# EasyEDA Pro project ProPrj_STM32门禁系统_2025-03-02.epro

# Schematic Schematic1

## Sheets
1 STM32主控: Board Name: Board1; Create Date: 2025-02-06; Page Name: STM32主控; Project Name: STM32门禁系统; Schematic Name: Schematic1; Update Date: 2025-03-01; Company: 嘉立创EDA; Page Size: A4; Version: V1.1
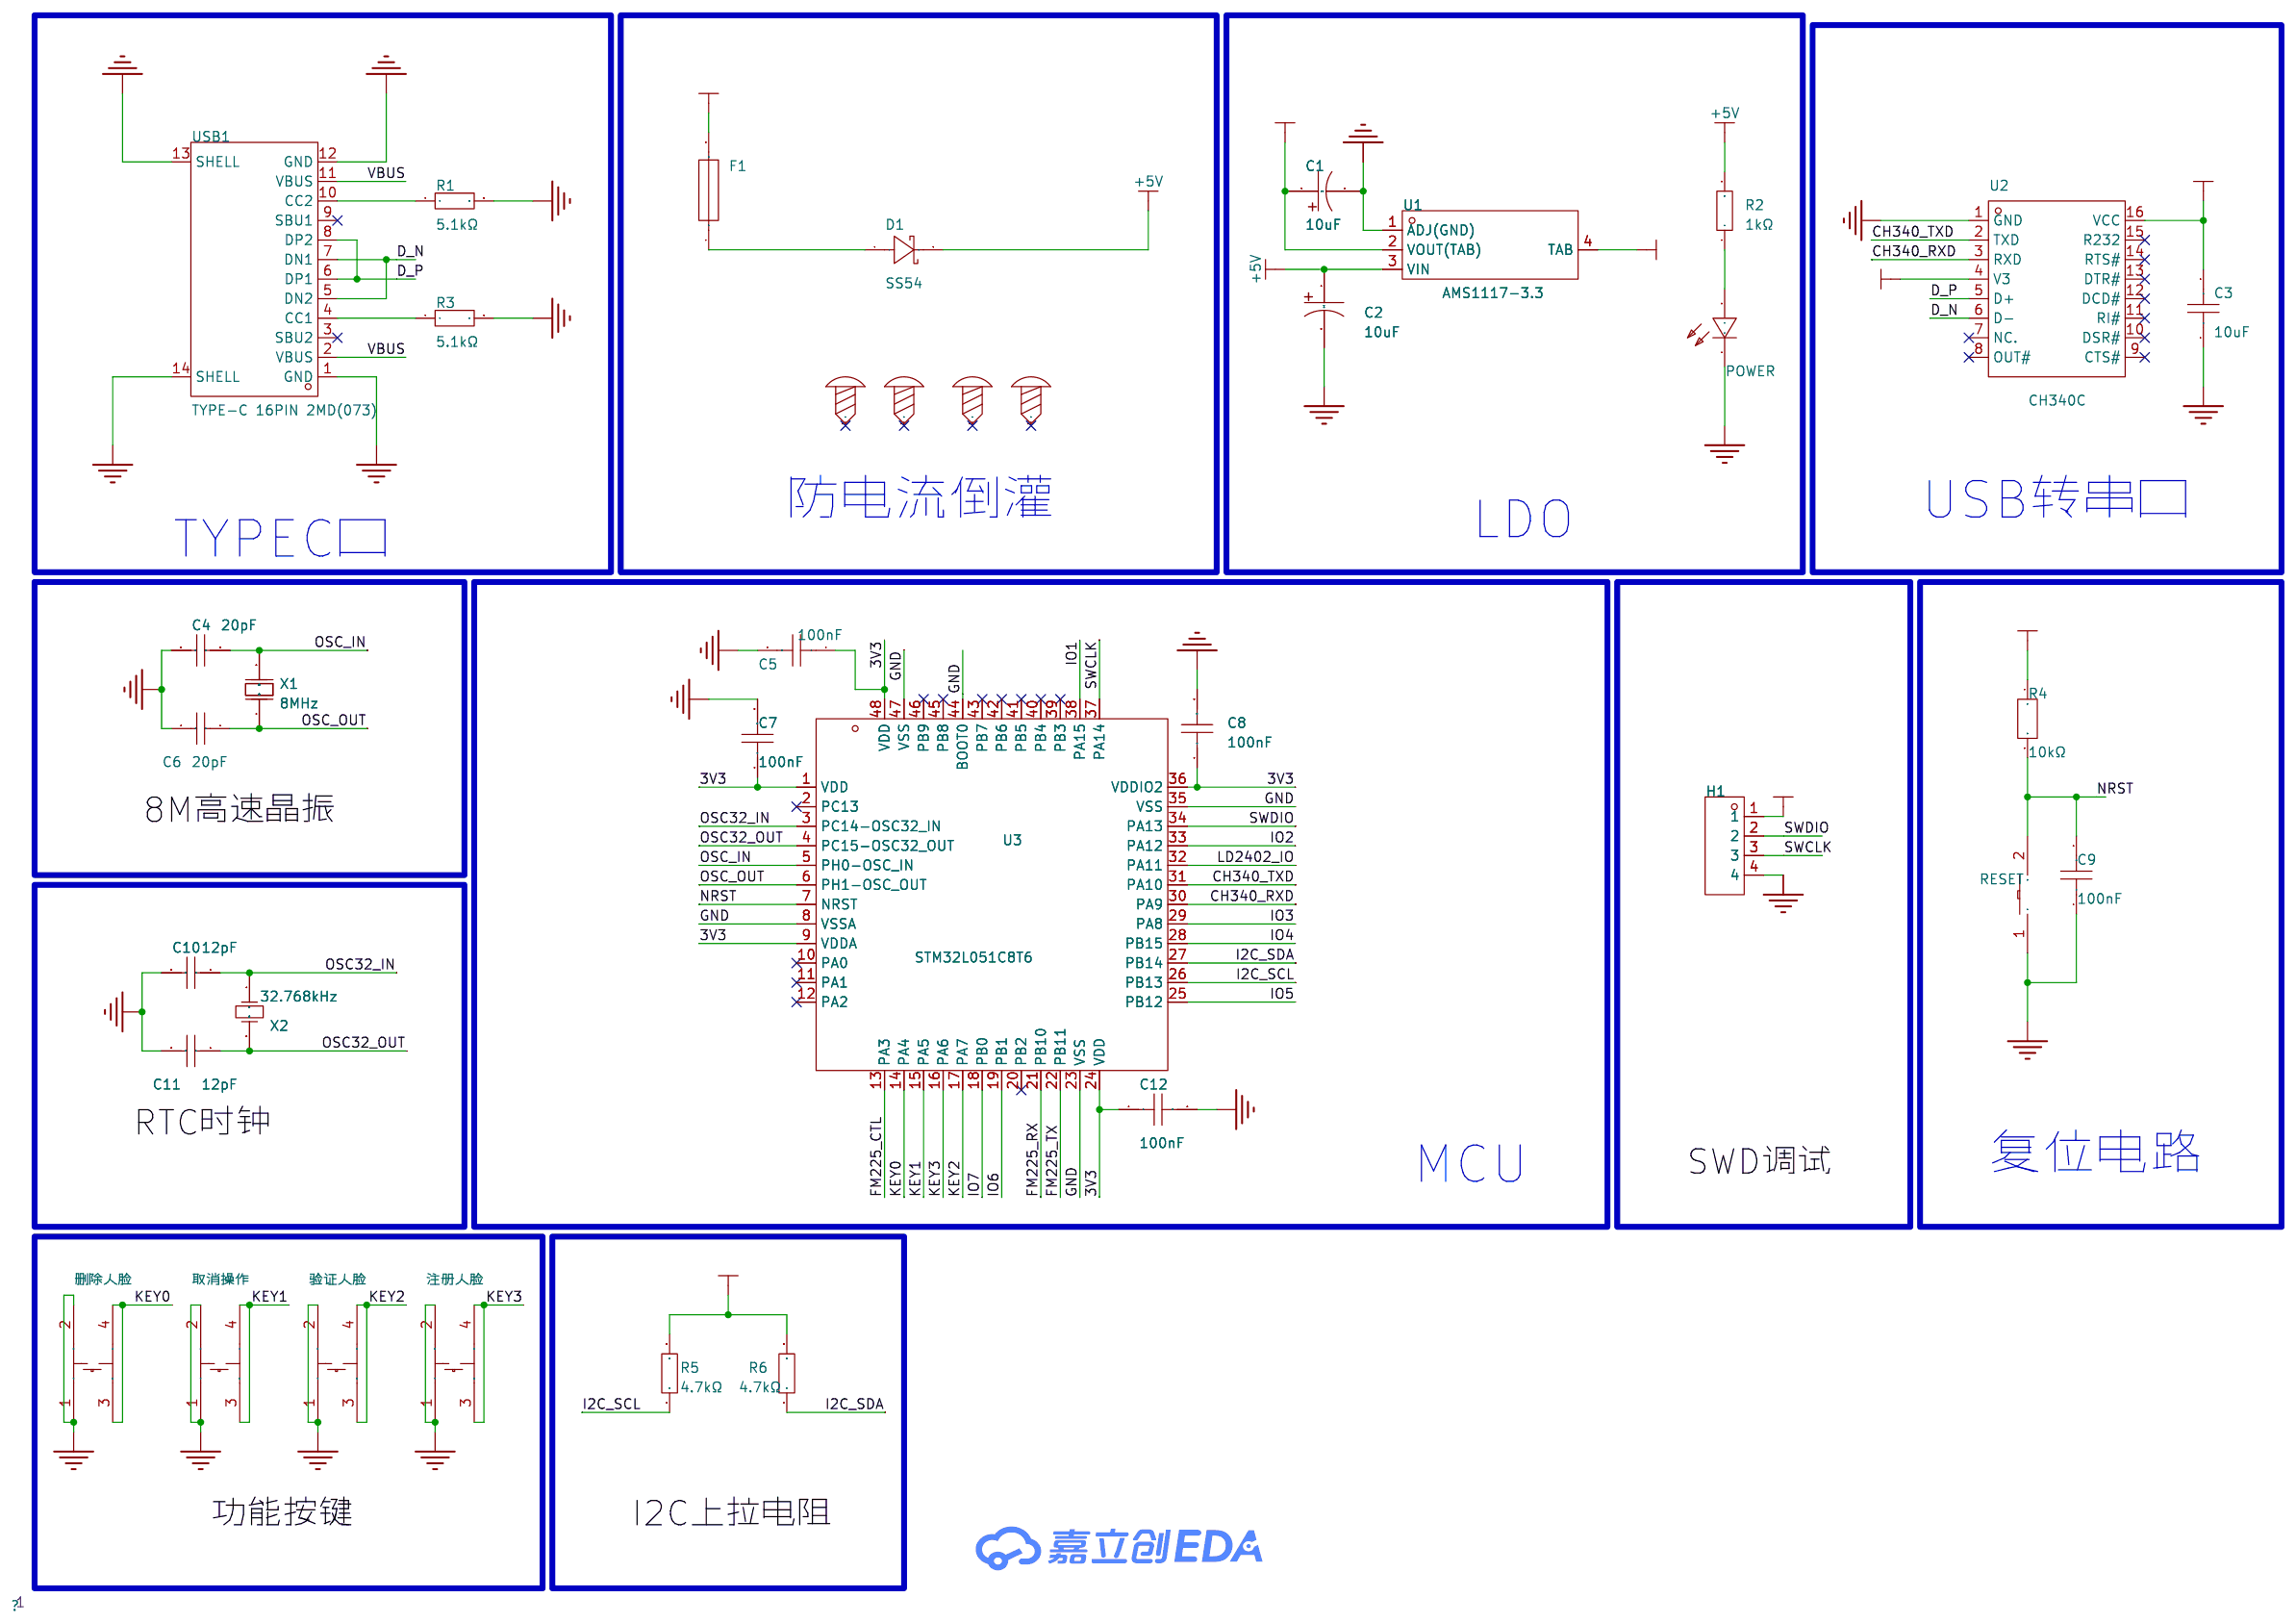
[diagram p0: STM32主控]
2 other: Page Name: other
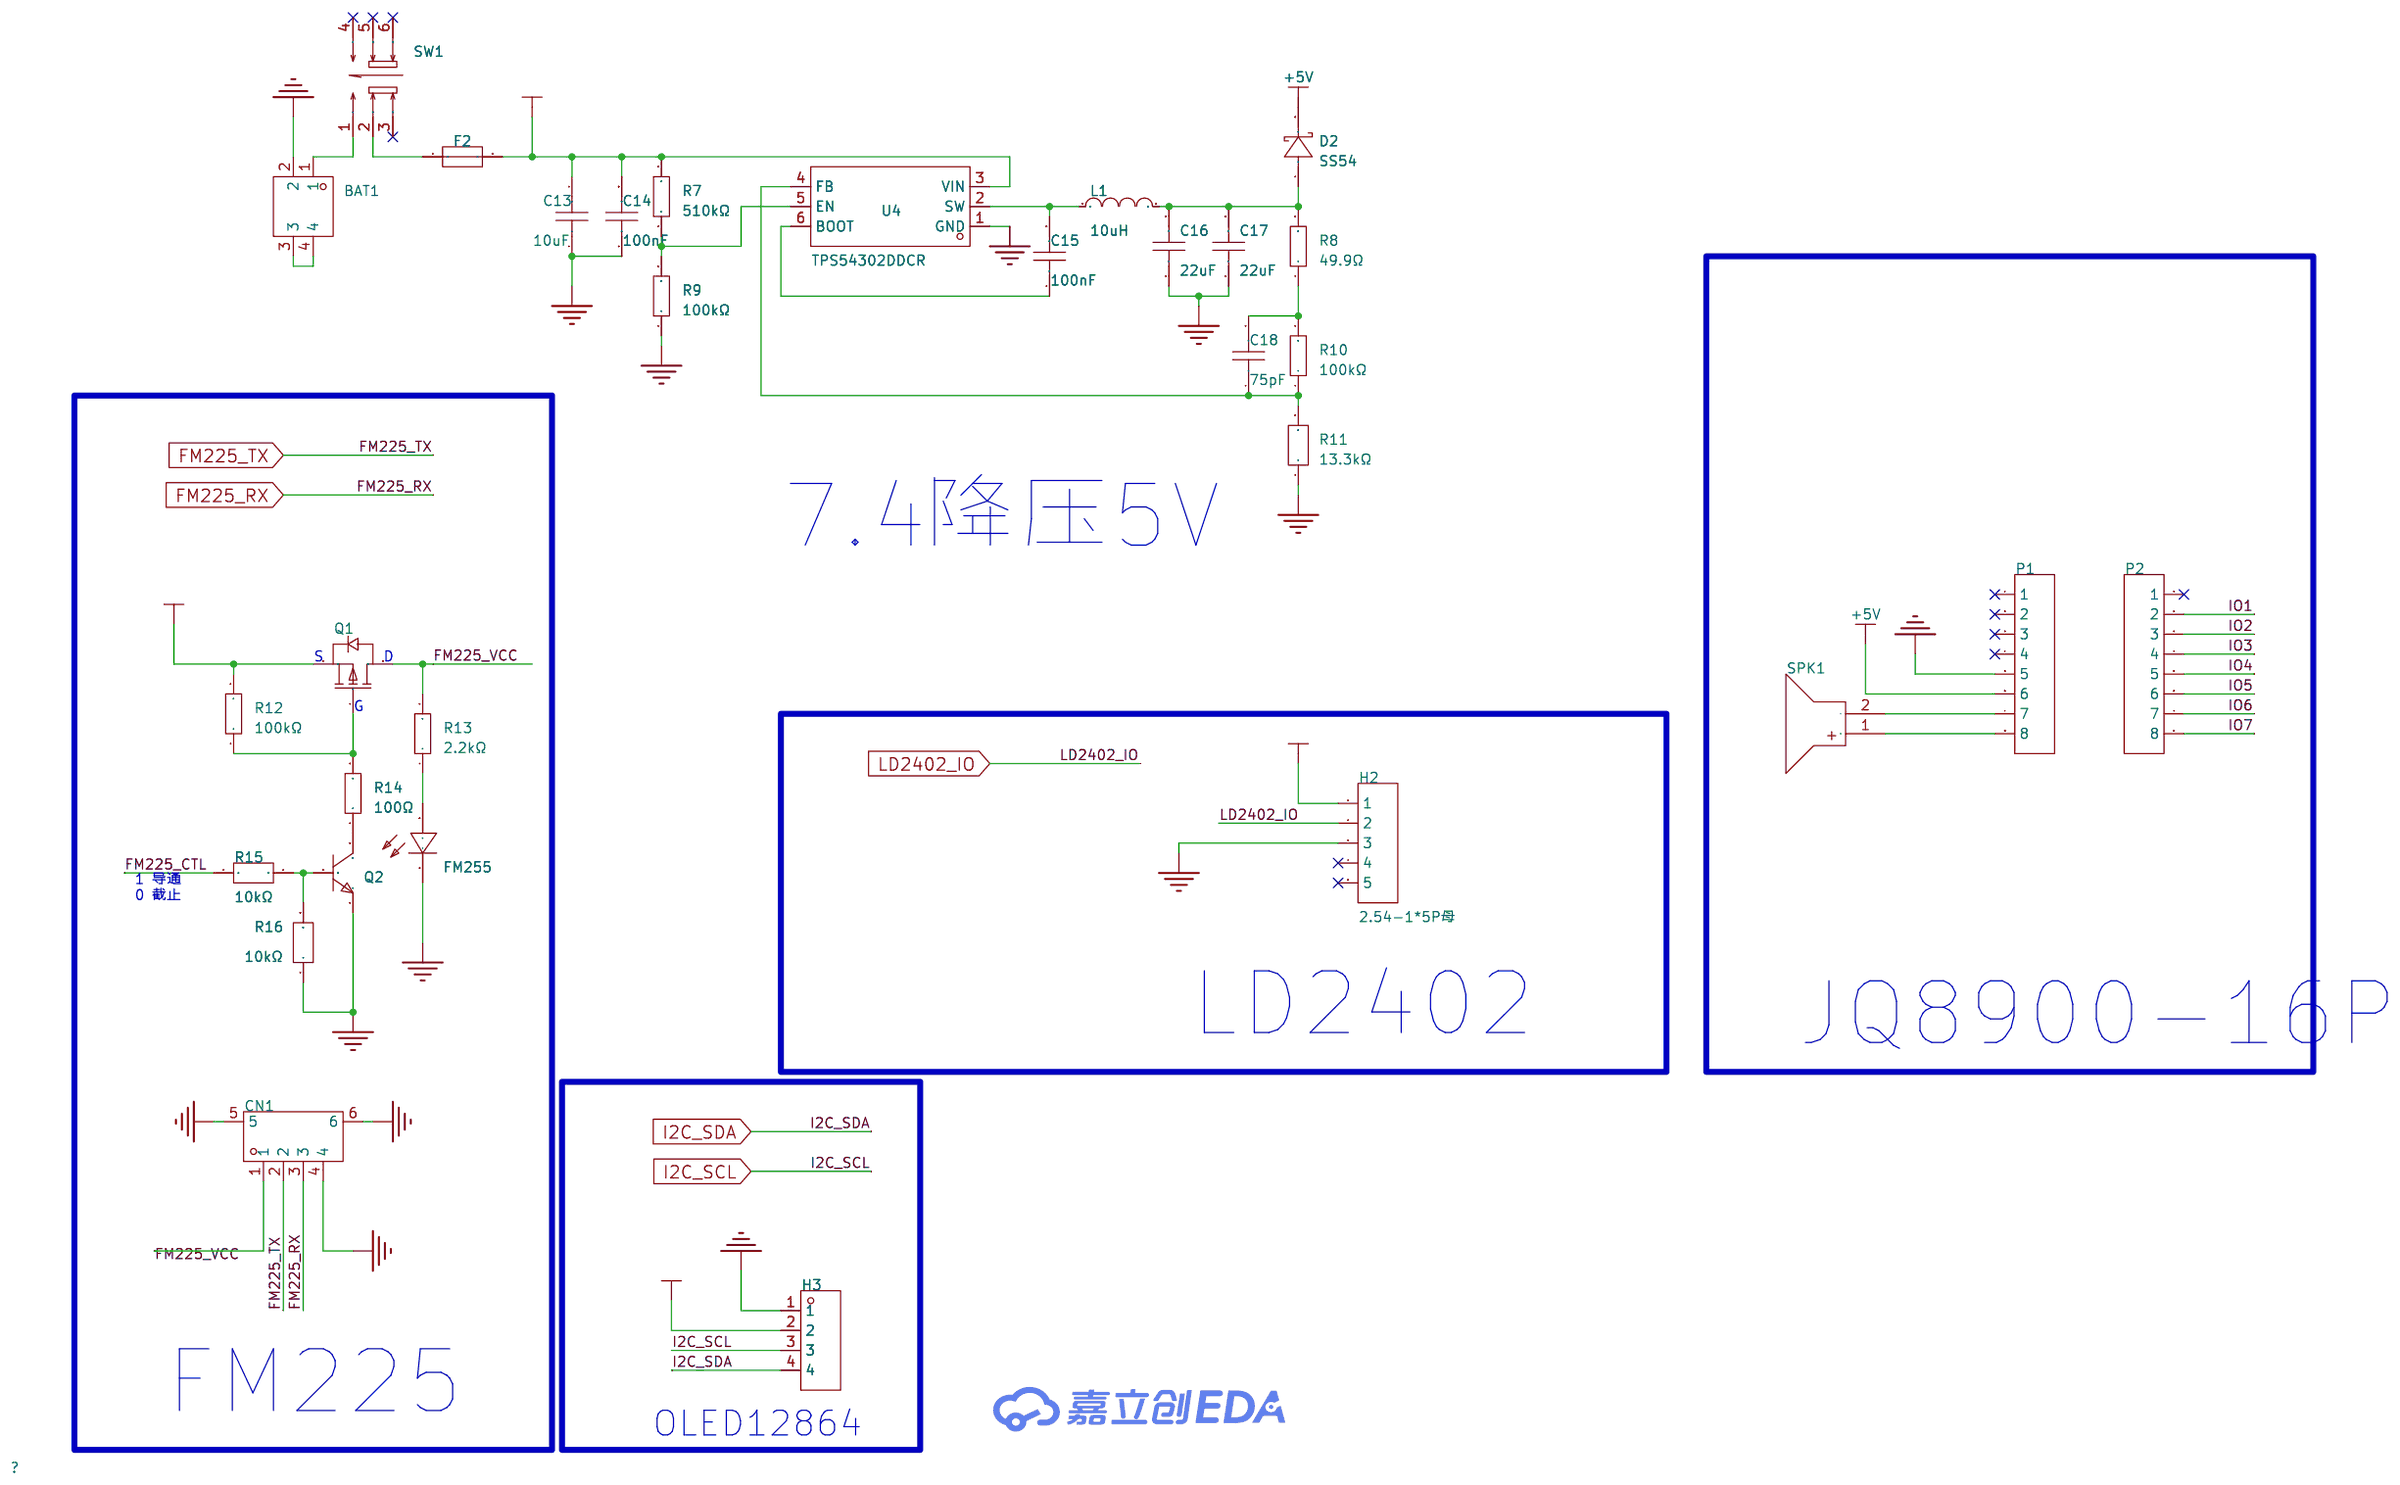
[diagram p1: other]

## Parts
sheet other
BAT1  BH-18650-A1BJ021  [BAT-TH_L77.0-W39.9_BH-18650-A1BJ021]
C13  10uF  [C0603]
C14  100nF  [C0603]
C15  100nF  [C0603]
C16  22uF  [C0603]
C17  22uF  [C0603]
C18  75pF  [C0603]
CN1  HC-1.25-4PLT  [CONN-SMD_4P-P1.25_HCTL_HC-1.25-4PLT]
D2  SS54  [SMA_L4.3-W2.6-LS5.0-FD]
F2  BSMD1210-150-16V  [F1210]
FM255  NCD0603W3  [LED0603-RD]
H2  2.54-1*5P母  [HDR-TH_5P-P2.54-V-F]
H3  2.54-1*4P母  [HDR-TH_4P-P2.54-V-F]
L1  10uH  [IND-SMD_L7.3-W6.8]
P1  2.54-1*8P母环保  [HDR-TH_8P-P2.54-V-F-1]
P2  2.54-1*8P母环保  [HDR-TH_8P-P2.54-V-F-1]
Q1  SI2301  [SOT-23-3_L2.9-W1.3-P1.90-LS2.4-BR]
Q2  S8050  [SOT-23-3_L2.9-W1.3-P1.90-LS2.4-BR]
R7  510kΩ  [R0603]
R8  49.9Ω  [R0603]
R9  100kΩ  [R0603]
R10  100kΩ  [R0603]
R11  13.3kΩ  [R0603]
R12  100kΩ  [R0603]
R13  2.2kΩ  [R0603]
R14  100Ω  [R0603]
R15  10kΩ  [R0603]
R16  10kΩ  [R0603]
SPK1  GSPK2307P-8R1W  [SPK-TH_BD23.0-P10.00-D0.8-L-RD]
SW1  XKB7070-Z  [SW-TH_6P-L7.0-W7.0-P2.00]
U4  TPS54302DDCR  [SOT-23-6_L2.9-W1.6-P0.95-LS2.8-BL]
sheet STM32主控
C1  10uF  [CAP-SMD_L3.2-W1.6]
C2  10uF  [CAP-SMD_L3.2-W1.6]
C3  10uF  [C0603]
C4  20pF  [C0603]
C5  100nF  [C0603]
C6  20pF  [C0603]
C7  100nF  [C0603]
C8  100nF  [C0603]
C9  100nF  [C0603]
C10  12pF  [C0603]
C11  12pF  [C0603]
C12  100nF  [C0603]
D1  SS54  [SMA_L4.3-W2.6-LS5.0-FD]
F1  JK-nSMD050-30  [F1206]
H1  PZ254V-11-04P  [HDR-TH_4P-P2.54-V-M]
POWER  NCD0603R1  [LED0603-RD_RED]
R1  5.1kΩ  [R0603]
R2  1kΩ  [R0603]
R3  5.1kΩ  [R0603]
R4  10kΩ  [R0603]
R5  4.7kΩ  [R0603]
R6  4.7kΩ  [R0603]
RESET  TS-1101-C-W  [SW-SMD_L6.0-W3.3-LS8.0]
SCREW1  -  [M2螺丝]  (no BOM)
SCREW2  -  [M2螺丝]  (no BOM)
SCREW3  -  [M2螺丝]  (no BOM)
SCREW4  -  [M2螺丝]  (no BOM)
U1  AMS1117-3.3  [SOT-223-4_L6.5-W3.5-P2.30-LS7.0-BR]
U2  CH340C  [SOP-16_L10.0-W3.9-P1.27-LS6.0-BL]
U3  STM32L051C8T6  [LQFP-48_L7.0-W7.0-P0.50-LS9.0-BL]
USB1  TYPE-C 16PIN 2MD(073)  [USB-C-SMD_TYPE-C-6PIN-2MD-073]
X1  8MHz  [HC-49US_L11.5-W4.5-P4.88]
X2  32.768kHz  [OSC-TH_BD3.1-P0.8-D0.3]
删除人脸  TS-1002S-06026C  [KEY-SMD_4P-L6.0-W6.0-P4.50-LS9.5-BR]
取消操作  TS-1002S-06026C  [KEY-SMD_4P-L6.0-W6.0-P4.50-LS9.5-BR]
注册人脸  TS-1002S-06026C  [KEY-SMD_4P-L6.0-W6.0-P4.50-LS9.5-BR]
验证人脸  TS-1002S-06026C  [KEY-SMD_4P-L6.0-W6.0-P4.50-LS9.5-BR]

## Library data of the parts
BAT1 = BH-18650-A1BJ021: 连接器类型:电池盒;适用电池规格:-;触点电镀:镍;工作温度范围:-25℃~+85℃;; LCSC Part Name: 电池盒; Supplier Part: C20606804; Manufacturer: MYOUNG(美阳); Supplier Footprint: 插件; JLCPCB Part Class: 扩展库; Datasheet: https://atta.szlcsc.com/upload/public/pdf/source/20240112/147D77B47FAFC966051AFF7CD950677D.pdf; Supplier: LCSC; Connector Type: 电池盒; Contact Plating: 镍; Operating Temperature Range: -25℃~+85℃
C3 C13 = CL10A106KP8NNNC: 容值:10uF;精度:±10%;额定电压:10V;材质(温度系数):X5R;; LCSC Part Name: 10uF ±10% 10V; Supplier Part: C19702; Manufacturer: SAMSUNG(三星); Supplier Footprint: 0603; JLCPCB Part Class: 基础库; Datasheet: https://atta.szlcsc.com/upload/public/pdf/source/20160218/1457707763339.pdf; Supplier: LCSC; Tolerance: ±10%; Voltage Rated: 10V; Temperature Coefficient: X5R
C5 C7-C9 C12 C14 C15 = CGA0603X7R104K500JT: 容值:100nF;精度:±10%;额定电压:50V;材质(温度系数):X7R;; LCSC Part Name: 100nF ±10% 50V; Supplier Part: C6119867; Manufacturer: HRE(芯声); Supplier Footprint: 0603; Supplier: LCSC; Tolerance: ±10%; Voltage Rated: 50V; Temperature Coefficient: X7R
C16 C17 = CL10A226MQ8NRNC: 容值:22uF;精度:±20%;额定电压:6.3V;材质(温度系数):X5R;; LCSC Part Name: 22uF ±20% 6.3V; Supplier Part: C59461; Manufacturer: SAMSUNG(三星); Supplier Footprint: 0603; JLCPCB Part Class: 基础库; Datasheet: https://atta.szlcsc.com/upload/public/pdf/source/20160218/1457707763339.pdf; Supplier: LCSC; Tolerance: ±20%; Voltage Rated: 6.3V; Temperature Coefficient: X5R
C18 = CC0603JRNPO9BN750: 容值:75pF;精度:±5%;额定电压:50V;材质(温度系数):NP0;; LCSC Part Name: 75pF ±5% 50V; Supplier Part: C282074; Manufacturer: YAGEO(国巨); Supplier Footprint: 0603; JLCPCB Part Class: 扩展库; Datasheet: https://atta.szlcsc.com/upload/public/pdf/source/20181008/C309499_21CC21451B82C39E3D92150FD6B30293.pdf; Supplier: LCSC; Tolerance: ±5%; Voltage Rated: 50V; Temperature Coefficient: NP0
CN1 = HC-1.25-4PLT: 插针结构:1x4P;间距:1.25mm;安装方式:立贴;参考系列:PicoBlade(MX 1.25);总PIN数:4P;排数:1;每排PIN数:4;行距:-;额定电流:2A;触头材质:黄铜;触头镀层:锡;工作温度范围:-25℃~+85℃;; LCSC Part Name: 1x4P 间距:1.25mm 立贴 系列:PicoBlade(MX 1.25); Supplier Part: C2845390; Manufacturer: HCTL(华灿天禄); Supplier Footprint: SMD,P=1.25mm; Datasheet: https://atta.szlcsc.com/upload/public/pdf/source/20230707/8E5913B5A3195C18F5EE12EA4CB86B82.pdf; Supplier: LCSC; Pins Structure: 1x4P; Pitch: 1.25mm; Mounting Style: 立贴; Reference Series: PicoBlade(MX 1.25); Number of Pins: 4P; Number of Rows: 1; Number of PINs Per Row: 4; Current Rating (Max): 2A; Contact Material: 黄铜; Contact Plating: 锡; Operating Temperature Range: -25℃~+85℃; Rated Voltage (Max): 250V; Plastic Material: LCP; Flame Retardant Rating: UL94V-0; Supplementary Features: 辅助焊脚; Z-Height of the Board: 4.75mm; X-Length of Bottom Edge on Board (Spacing Line): 9.8mm; Y-Width of Bottom Edge on Board: 4.2mm
D1 D2 = SS54_C7420369: 二极管配置:独立式;正向压降(Vf):550mV@5.0A;直流反向耐压(Vr):40V;整流电流:5A;; LCSC Part Name: 电压:40V 电流:5A; Supplier Part: C7420369; Manufacturer: 宏迦橙; Supplier Footprint: SMA(DO-214AC); JLCPCB Part Class: 扩展库; Datasheet: https://atta.szlcsc.com/upload/public/pdf/source/20230828/254C3882F8647358AD9F60DD73611B5E.pdf; Supplier: LCSC; Diode Configuration: 独立式; Forward Voltage (Vf@If): 550mV@5.0A; Reverse Voltage (Vr): 40V; Rectified Current: 5A; Reverse Leakage Current (Ir): 50uA@40V
F2 = BSMD1210-150-16V: 最大电压:16V;最大电流:100A;保持电流:1.5A;跳闸电流:3A;; LCSC Part Name: 16V 1.5A 1210自恢复; Supplier Part: C7589021; Manufacturer: BHFUSE(佰宏); Supplier Footprint: 1210; JLCPCB Part Class: 扩展库; Datasheet: https://atta.szlcsc.com/upload/public/pdf/source/20230901/3BD0067D95828A491069C1326596E15D.pdf; Supplier: LCSC; Operating Voltage (Max): 16V; Current Rating (Max): 100A; Hold Current: 1.5A; Trip Current: 3A; Power Dissipation: 800mW; Resistance - Initial (Ri) (Min): 30mΩ; Resistance - Post Trip (R1) (Max): 110mΩ; Maximum Time to Trip: 500ms; Operating Temperature: -40℃~+85℃
FM255 = NCD0603W3: 发光颜色:白色;正向电压(VF):2.6V~3.6V;功率:72mW;正向电流:20mA;透镜颜色:雾状黄透镜;发光强度:630mcd~1020mcd;发光角度:130°;工作温度:-30℃~+85℃;; Supplier Part: C158100; Manufacturer: 国星光电; Supplier Footprint: 0603; Datasheet: https://atta.szlcsc.com/upload/public/pdf/source/20200820/C158100_50925859265E69D0E7B693294CA0E48C.pdf; Supplier: LCSC; Emitted Color: 白色; Forward Voltage (VF): 2.6V~3.6V; Power Dissipation: 72mW; Forward Current: 20mA; Lens Color: 雾状黄透镜; Luminous Intensity: 630mcd~1020mcd; Viewing Angle: 130°; Operating Temperature: -30℃~+85℃
H2 = 2.54-1*5P母: 插孔结构:1x5P;间距:2.54mm;行距:-;安装类型:直插;排数:单排;总孔位数:5P;塑高:-;触头材质:-;触头镀层:-;; LCSC Part Name: 间距:2.54mm 1x5P 直插; Supplier Part: C50950; Manufacturer: BOOMELE(博穆精密); Supplier Footprint: 插件,P=2.54mm; JLCPCB Part Class: 扩展库; Datasheet: https://atta.szlcsc.com/upload/public/pdf/source/20210301/C2718488_F4427B881E42CAA8DDB0B1C12B3A522C.pdf; Supplier: LCSC; Holes Structure: 1x5P; Pitch: 2.54mm; Mounting Type: 直插; Number of Rows: 单排; Number of Holes: 5P
H3 = 2.54-1*4P母: 插孔结构:1x4P;间距:2.54mm;行距:-;圆孔/方孔:方孔;安装类型:直插;排数:单排;总孔位数:4P;额定电流:3A;额定电压:-;插孔方向:顶部;塑高:-;触头材质:青铜;触头镀层:-;工作温度范围:-40℃~+105℃;焊接温度(最大值):-;; LCSC Part Name: 间距:2.54mm 1x4P 直插; Supplier Part: C2718488; Manufacturer: BOOMELE(博穆精密); Supplier Footprint: 插件,P=2.54mm; JLCPCB Part Class: 扩展库; Datasheet: https://atta.szlcsc.com/upload/public/pdf/source/20210301/C2718488_F4427B881E42CAA8DDB0B1C12B3A522C.pdf; Supplier: LCSC; Holes Structure: 1x4P; Pitch: 2.54mm; Circular Hole / Square Hole: 方孔; Mounting Type: 直插; Number of Rows: 单排; Number of Holes: 4P; Current Rating (Max): 3A; Holes Direction: 顶部; Contact Material: 青铜; Operating Temperature Range: -40℃~+105℃
L1 = FXL0630-100-M: 电感值:10uH;精度:±20%;额定电流:4.5A;饱和电流(Isat):5.5A;类型:一体成型电感;; LCSC Part Name: 10uH ±20% 5.5A; Supplier Part: C167223; Manufacturer: cjiang(长江微电); Supplier Footprint: SMD,6.6x7mm; JLCPCB Part Class: 扩展库; Datasheet: https://atta.szlcsc.com/upload/public/pdf/source/20240426/3189EA8206330E2108542F9E34E540E7.pdf; Supplier: LCSC; Tolerance: ±20%; Rated Current: 4.5A; Saturation Current (Isat): 5.5A; DC Resistance (DCR): 68mΩ; Type: 一体成型电感
P1 P2 = 2.54-1*8P母环保: 插孔结构:1x8P;间距:2.54mm;行距:-;安装类型:直插;排数:单排;总孔位数:8P;塑高:-;触头材质:-;触头镀层:-;; LCSC Part Name: 间距:2.54mm 1x8P 直插; Supplier Part: C27438; Manufacturer: BOOMELE(博穆精密); Supplier Footprint: 插件,P=2.54mm; JLCPCB Part Class: 扩展库; Datasheet: https://atta.szlcsc.com/upload/public/pdf/source/20231221/1CA800C6799ED97958773716FAA1BFFE.pdf; Supplier: LCSC; Holes Structure: 1x8P; Pitch: 2.54mm; Mounting Type: 直插; Number of Rows: 单排; Number of Holes: 8P
Q1 = SI2301_C2891731: 类型:1个P沟道;漏源电压(Vdss):20V;连续漏极电流(Id):2.2A;导通电阻(RDS(on)@Vgs,Id):120mΩ@4.5V,1.5A;功率(Pd):700mW;阈值电压(Vgs(th)@Id):1.5V@250uA;; LCSC Part Name: P沟道,电流:2.2A,耐压:20V; Supplier Part: C2891731; Manufacturer: YONGYUTAI(永裕泰); Supplier Footprint: SOT-23; JLCPCB Part Class: 扩展库; Datasheet: https://atta.szlcsc.com/upload/public/pdf/source/20210901/BD7F488CADB80954861F21BEE026F08A.pdf; Supplier: LCSC; Type: 1个P沟道; Drain Source Voltage (Vdss): 20V; Continuous Drain Current (Id): 2.2A; Drain Source On Resistance (RDS(on)@Vgs,Id): 120mΩ@4.5V,1.5A; Power Dissipation (Pd): 700mW; Gate Threshold Voltage (Vgs(th)@Id): 1.5V@250uA; Input Capacitance (Ciss@Vds): 200pF@10V; Operating Temperature: -55℃~+150℃
Q2 = S8050_C2891804: 晶体管类型:NPN;集电极电流(Ic):500mA;集射极击穿电压(Vceo):25V;功率(Pd):300mW;直流电流增益(hFE@Ic,Vce):400@50mA,1V;; LCSC Part Name: NPN 电流:500mA 耐压:25V; Supplier Part: C2891804; Manufacturer: YONGYUTAI(永裕泰); Supplier Footprint: SOT-23; JLCPCB Part Class: 扩展库; Datasheet: https://atta.szlcsc.com/upload/public/pdf/source/20210901/5347316A10609C628D4D69AE01446E5B.pdf; Supplier: LCSC; Transistor Type: NPN; Collector Current (Ic): 500mA; Collector-Emitter Breakdown Voltage (Vceo): 25V; Power Dissipation (Pd): 300mW; DC Current Gain (hFE@Ic,Vce): 400@50mA,1V; Collector Cut-Off Current (Icbo): 1uA; Collector-Emitter Saturation Voltage (VCE(sat)@Ic,Ib): 500mV@500mA,50mA
R7 = 0603WAF5103T5E: 电阻类型:厚膜电阻;阻值:510kΩ;精度:±1%;功率:100mW;最大工作电压:75V;温度系数:±100ppm/℃;; LCSC Part Name: 510kΩ ±1% 100mW 厚膜电阻; Supplier Part: C23192; Manufacturer: UNI-ROYAL(厚声); Supplier Footprint: 0603; JLCPCB Part Class: 基础库; Datasheet: https://atta.szlcsc.com/upload/public/pdf/source/20200306/C422600_1E6D84923E4A46A82E41ADD87F860B5C.pdf; Supplier: LCSC; Type: 厚膜电阻; Tolerance: ±1%; Power(Watts): 100mW; Overload Voltage (Max): 75V; Temperature Coefficient: ±100ppm/℃; Operating Temperature Range: -55℃~+155℃
R8 = 0603WAF499JT5E: 电阻类型:厚膜电阻;阻值:49.9Ω;精度:±1%;功率:100mW;最大工作电压:75V;温度系数:±100ppm/℃;; LCSC Part Name: 49.9Ω ±1% 100mW 厚膜电阻; Supplier Part: C23185; Manufacturer: UNI-ROYAL(厚声); Supplier Footprint: 0603; JLCPCB Part Class: 基础库; Datasheet: https://atta.szlcsc.com/upload/public/pdf/source/20200306/C422600_1E6D84923E4A46A82E41ADD87F860B5C.pdf; Supplier: LCSC; Type: 厚膜电阻; Tolerance: ±1%; Power(Watts): 100mW; Overload Voltage (Max): 75V; Temperature Coefficient: ±100ppm/℃; Operating Temperature Range: -55℃~+155℃
R9 R10 R12 = 0603WAJ0104T5E: 电阻类型:厚膜电阻;阻值:100kΩ;精度:±5%;功率:100mW;最大工作电压:75V;温度系数:±100ppm/℃;; LCSC Part Name: 100kΩ ±5% 100mW 厚膜电阻; Supplier Part: C15458; Manufacturer: UNI-ROYAL(厚声); Supplier Footprint: 0603; JLCPCB Part Class: 扩展库; Datasheet: https://atta.szlcsc.com/upload/public/pdf/source/20200306/C422600_1E6D84923E4A46A82E41ADD87F860B5C.pdf; Supplier: LCSC; Type: 厚膜电阻; Tolerance: ±5%; Power(Watts): 100mW; Overload Voltage (Max): 75V; Temperature Coefficient: ±100ppm/℃; Operating Temperature Range: -55℃~+155℃
R11 = FRC0603F1332TS: 电阻类型:厚膜电阻;阻值:13.3kΩ;精度:±1%;功率:100mW;最大工作电压:75V;温度系数:±100ppm/℃;; LCSC Part Name: 13.3kΩ ±1% 100mW 厚膜电阻; Supplier Part: C2933140; Manufacturer: FOJAN(富捷); Supplier Footprint: 0603; JLCPCB Part Class: 扩展库; Datasheet: https://atta.szlcsc.com/upload/public/pdf/source/20211221/925EC7D7225764EE0046F22065062C87.pdf; Supplier: LCSC; Type: 厚膜电阻; Tolerance: ±1%; Power(Watts): 100mW; Overload Voltage (Max): 75V; Temperature Coefficient: ±100ppm/℃; Operating Temperature Range: -55℃~+155℃
R13 = 0603WAF2201T5E: 电阻类型:厚膜电阻;阻值:2.2kΩ;精度:±1%;功率:100mW;最大工作电压:75V;温度系数:±100ppm/℃;; LCSC Part Name: 2.2kΩ ±1% 100mW 厚膜电阻; Supplier Part: C4190; Manufacturer: UNI-ROYAL(厚声); Supplier Footprint: 0603; JLCPCB Part Class: 基础库; Datasheet: https://atta.szlcsc.com/upload/public/pdf/source/20200306/C422600_1E6D84923E4A46A82E41ADD87F860B5C.pdf; Supplier: LCSC; Type: 厚膜电阻; Tolerance: ±1%; Power(Watts): 100mW; Overload Voltage (Max): 75V; Temperature Coefficient: ±100ppm/℃; Operating Temperature Range: -55℃~+155℃
R14 = 0603WAF1000T5E: 电阻类型:厚膜电阻;阻值:100Ω;精度:±1%;功率:100mW;最大工作电压:75V;温度系数:±200ppm/℃;; LCSC Part Name: 100Ω ±1% 100mW 厚膜电阻; Supplier Part: C22775; Manufacturer: UNI-ROYAL(厚声); Supplier Footprint: 0603; Datasheet: https://atta.szlcsc.com/upload/public/pdf/source/20200306/C422600_1E6D84923E4A46A82E41ADD87F860B5C.pdf; Supplier: LCSC; Type: 厚膜电阻; Tolerance: ±1%; Power(Watts): 100mW; Overload Voltage (Max): 75V; Temperature Coefficient: ±200ppm/℃; Operating Temperature Range: -55℃~+155℃
R4 R15 R16 = FRC0603J103TS: 电阻类型:厚膜电阻;阻值:10kΩ;精度:±5%;功率:100mW;最大工作电压:75V;温度系数:±100ppm/℃;; LCSC Part Name: 10kΩ ±5% 100mW 厚膜电阻; Supplier Part: C2930027; Manufacturer: FOJAN(富捷); Supplier Footprint: 0603; JLCPCB Part Class: 扩展库; Datasheet: https://atta.szlcsc.com/upload/public/pdf/source/20211221/925EC7D7225764EE0046F22065062C87.pdf; Supplier: LCSC; Type: 厚膜电阻; Tolerance: ±5%; Power(Watts): 100mW; Overload Voltage (Max): 75V; Temperature Coefficient: ±100ppm/℃; Operating Temperature Range: -55℃~+155℃
SPK1 = GSPK2307P-8R1W: Supplier Part: C530531; Manufacturer: INGHAi(赢海); JLCPCB Part Class: 扩展库; Datasheet: https://atta.szlcsc.com/upload/public/pdf/source/20200723/C530531_BBB4236C037415C04A54E89A31B50803.pdf; Supplier: LCSC
SW1 = XKB7070-Z: 自锁/无锁:自锁;安装方式:直插;触点电流:100mA;额定电压 (AC):250V;额定电压 (DC):30V;带灯:不带;作用力:160gf;机械寿命:10万次;; LCSC Part Name: 按键开关   7*7插件自锁 蓝白黑; Supplier Part: C318863; Manufacturer: XKB Connectivity(中国星坤); Supplier Footprint: 插件; Datasheet: https://atta.szlcsc.com/upload/public/pdf/source/20211015/75A682A27A424BDE8D93C2CFA14C38FE.pdf; Supplier: LCSC; Self Lock / No Lock: 自锁; Actuator Style: 矩形按钮; Mounting Style: 直插; Contact Current: 100mA; Voltage Rating (AC): 250V; Voltage Rating (DC): 30V; Insulation Resistance: 100MΩ; Actuator/Cap Color: 蓝色; With Lamp: 不带; Pin Style: PC引脚; Operating Force: 160gf; Operating Temperature: -15℃~+55℃; Mechanical Life: 10万次
U4 = TPS54302DDCR: 功能类型:降压型;输出类型:固定;工作电压:4.5V~28V;输出电压:5V;输出电流:3A;; LCSC Part Name: 4.5V至28V输入、3A输出、EMI友好的同步降压转换器; Supplier Part: C311983; Manufacturer: TI(德州仪器); Supplier Footprint: TSOT-23-6; JLCPCB Part Class: 扩展库; Datasheet: https://www.ti.com/cn/lit/gpn/tps54302; Supplier: LCSC; Function: 降压型; Output Type: 固定; Input Voltage: 4.5V~28V; Output Voltage: 5V; Output Current: 3A; Switching Frequency: 400kHz; Operating Temperature: -40℃~+125℃; Synchronous Rectification: 是; Number of Outputs: 1; Topology: 降压式; Quiescent Current (Iq): 45uA; Switch tube (built-in/external): 内置
C1 C2 = CA45-A-16V-10μF-K: 容值:10uF;精度:±10%;额定电压:16V;等效串联电阻:2Ω@100kHz;; LCSC Part Name: 10uF ±10% 16V; Supplier Part: C185774; Manufacturer: TORCH(火炬); Supplier Footprint: CASE-A-3216-16(mm); JLCPCB Part Class: 扩展库; Datasheet: https://atta.szlcsc.com/upload/public/pdf/source/20180731/C185774_22D18ADF2389DA8E0E2B47A85772FA52.pdf; Supplier: LCSC; Tolerance: ±10%; Rated Voltage: 16V; Equivalent Series Resistance(ESR): 2Ω@100kHz; Operating Temperature: -55℃~+125℃
C4 C6 = CL10C200JB8NNNC: 容值:20pF;精度:±5%;额定电压:50V;材质(温度系数):C0G;; LCSC Part Name: 20pF ±5% 50V; Supplier Part: C1648; Manufacturer: SAMSUNG(三星); Supplier Footprint: 0603; JLCPCB Part Class: 基础库; Datasheet: https://atta.szlcsc.com/upload/public/pdf/source/20160218/1457707763339.pdf; Supplier: LCSC; Tolerance: ±5%; Voltage Rated: 50V; Temperature Coefficient: C0G
C10 C11 = CL10C120JB8NNNC: 容值:12pF;精度:±5%;额定电压:50V;材质(温度系数):C0G;; LCSC Part Name: 12pF ±5% 50V; Supplier Part: C38523; Manufacturer: SAMSUNG(三星); Supplier Footprint: 0603; JLCPCB Part Class: 基础库; Datasheet: https://atta.szlcsc.com/upload/public/pdf/source/20160218/1457707763339.pdf; Supplier: LCSC; Tolerance: ±5%; Voltage Rated: 50V; Temperature Coefficient: C0G
F1 = JK-nSMD050-30: 最大电压:30V;最大电流:100A;保持电流:500mA;跳闸电流:1A;; LCSC Part Name: 30V 500mA 1206自恢复; Supplier Part: C720075; Manufacturer: JK(金科); Supplier Footprint: 1206; JLCPCB Part Class: 扩展库; Datasheet: https://atta.szlcsc.com/upload/public/pdf/source/20200810/C720075_06AF2D4541537091880CC35F0EFB49F8.pdf; Supplier: LCSC; Operating Voltage (Max): 30V; Current Rating (Max): 100A; Hold Current: 500mA; Trip Current: 1A; Power Dissipation: 600mW; Resistance - Initial (Ri) (Min): 150mΩ; Resistance - Post Trip (R1) (Max): 300mΩ; Maximum Time to Trip: 100ms; Operating Temperature: -40℃~+85℃
H1 = PZ254V-11-04P: 插针结构:1x4P;间距:2.54mm;行距:-;圆针/方针:方针;安装类型:直插;排数:单排;总PIN位数:4P;额定电流:3A;额定电压:250V;配合针长度:6mm;塑高:2.5mm;端接针长度:3mm;触头材质:-;工作温度范围:-40℃~+105℃;颜色:黑色;; LCSC Part Name: 间距:2.54mm 1x4P 直插 方针; Supplier Part: C2691448; Manufacturer: XFCN(兴飞); Supplier Footprint: 插件,P=2.54mm; JLCPCB Part Class: 扩展库; Datasheet: https://atta.szlcsc.com/upload/public/pdf/source/20200309/C492403_F9F19131791D08044AD4F84F8E751A34.pdf; Supplier: LCSC; Pin Structure: 1x4P; Pitch: 2.54mm; Circluar Pins/Square Pins: 方针; Mounting Type: 直插; Number of Rows: 单排; Number of Pins: 4P; Current Rating (Max): 3A; Voltage Rating (Max): 250V; Length of Mating Pin: 6mm; Insulation Height: 2.5mm; Length of End Connection Pin: 3mm; Operating Temperature Range: -40℃~+105℃; Color: 黑色
POWER = NCD0603R1_C84263: 灯头类型:-;发光颜色:红色;正向电压(VF):1.6V~2.6V;功率:65mW;正向电流:20mA;主波长:615nm~630nm;二极管配置:独立二极管;透镜颜色:无色透明透镜;色温:-;发光强度:80mcd~220mcd;发光角度:130°;载带方式:-;工作温度:-30℃~+85℃;; Supplier Part: C84263; Manufacturer: 国星光电; Supplier Footprint: 0603; JLCPCB Part Class: 扩展库; Datasheet: https://atta.szlcsc.com/upload/public/pdf/source/20200820/C84263_DABC6A75E58F576973B407FDBA283D60.pdf; Supplier: LCSC; Emitted Color: 红色; Forward Voltage (VF): 1.6V~2.6V; Power Dissipation: 65mW; Forward Current: 20mA; Dominant Wavelength: 615nm~630nm; Diode Configuration: 独立二极管; Lens Color: 无色透明透镜; Luminous Intensity: 80mcd~220mcd; Viewing Angle: 130°; Operating Temperature: -30℃~+85℃
R1 R3 = 0603WAF5101T5E: 电阻类型:厚膜电阻;阻值:5.1kΩ;精度:±1%;功率:100mW;最大工作电压:75V;温度系数:±100ppm/℃;; LCSC Part Name: 5.1kΩ ±1% 100mW 厚膜电阻; Supplier Part: C23186; Manufacturer: UNI-ROYAL(厚声); Supplier Footprint: 0603; JLCPCB Part Class: Basic Part; Datasheet: https://atta.szlcsc.com/upload/public/pdf/source/20200306/C422600_1E6D84923E4A46A82E41ADD87F860B5C.pdf; Supplier: LCSC; Type: 厚膜电阻; Tolerance: ±1%; Power(Watts): 100mW; Overload Voltage (Max): 75V; Temperature Coefficient: ±100ppm/℃; Operating Temperature Range: -55℃~+155℃
R2 = 0603WAF1001T5E: 电阻类型:厚膜电阻;阻值:1kΩ;精度:±1%;功率:100mW;最大工作电压:75V;温度系数:±100ppm/℃;; LCSC Part Name: 1kΩ ±1% 100mW 厚膜电阻; Supplier Part: C21190; Manufacturer: UNI-ROYAL(厚声); Supplier Footprint: 0603; JLCPCB Part Class: 基础库; Datasheet: https://atta.szlcsc.com/upload/public/pdf/source/20200306/C422600_1E6D84923E4A46A82E41ADD87F860B5C.pdf; Supplier: LCSC; Type: 厚膜电阻; Tolerance: ±1%; Power(Watts): 100mW; Overload Voltage (Max): 75V; Temperature Coefficient: ±100ppm/℃; Operating Temperature Range: -55℃~+155℃
R5 R6 = 0603WAF4701T5E: 电阻类型:厚膜电阻;阻值:4.7kΩ;精度:±1%;功率:100mW;最大工作电压:75V;温度系数:±100ppm/℃;; LCSC Part Name: 4.7kΩ ±1% 100mW 厚膜电阻; Supplier Part: C23162; Manufacturer: UNI-ROYAL(厚声); Supplier Footprint: 0603; JLCPCB Part Class: 基础库; Datasheet: https://atta.szlcsc.com/upload/public/pdf/source/20200306/C422600_1E6D84923E4A46A82E41ADD87F860B5C.pdf; Supplier: LCSC; Type: 厚膜电阻; Tolerance: ±1%; Power(Watts): 100mW; Overload Voltage (Max): 75V; Temperature Coefficient: ±100ppm/℃; Operating Temperature Range: -55℃~+155℃
RESET = TS-1101-C-W: 电路结构:单刀单掷;按钮形状:矩形按钮;作用力:260gf;安装方式:立贴;开关长度:6mm;开关宽度:3.6mm;开关高度:2.5mm;带支架:不带;触点电流:50mA;额定电压(AC):-;额定电压(DC):12V;额定功率:-;绝缘电阻:-;带灯:无;机械寿命:5万次;; LCSC Part Name: 6*3.6*2.5mm 立贴 轻触开关; Supplier Part: C318938; Manufacturer: XKB Connectivity(中国星坤); Supplier Footprint: SMD; Datasheet: https://atta.szlcsc.com/upload/public/pdf/source/20200227/C318938_C2E53B1EEDE37D980A33616AC086DE53.pdf; Supplier: LCSC; Circuit: 单刀单掷; Actuator Style: 矩形按钮; Operating Force: 260gf; Mounting Style: 立贴; Switch Length: 6mm; Switch Width: 3.6mm; Switch Height: 2.5mm; Strike Gundam: 不带; Contact Current: 50mA; Voltage Rating (DC): 12V; Actuator/Cap Color: 白色带淡绿; With Lamp: 无; Mechanical Life: 5万次; Operating Temperature: -30℃~+85℃
SCREW1-SCREW4 = M2螺丝: Supplier Footprint: 插件; Check: false
U1 = AMS1117-3.3_C347222: 输出类型:固定;工作电压:12V;输出电压:3.3V;输出电流:1A;电源纹波抑制比(PSRR):60dB@(120Hz);输出极性:正极;; LCSC Part Name: 输出:3.3V 电流:1A 耐压:12V; Supplier Part: C347222; Manufacturer: UMW(友台半导体); Supplier Footprint: SOT-223; JLCPCB Part Class: 扩展库; Datasheet: https://atta.szlcsc.com/upload/public/pdf/source/20241218/BAF0263FA2E44BCD8AF41AA4FA04EFAA.pdf; Supplier: LCSC; Output Type: 固定; Maximum Input Voltage: 12V; Output Voltage: 3.3V; Output Current: 1A; Power Supply Rejection Ratio (PSRR): 60dB@(120Hz); Dropout Voltage: 1.3V@(1A); Feature: 过流保护(OCP); Output Polarity: 正极; Number of Outputs: 1
U2 = CH340C: 应用功能:收发器;接口协议:USB 2.0;数据速率:2Mbps;; LCSC Part Name: CH340C USB转串口芯片 CH340; Supplier Part: C84681; Manufacturer: WCH(南京沁恒); Supplier Footprint: SOP-16; JLCPCB Part Class: 扩展库; Datasheet: https://atta.szlcsc.com/upload/public/pdf/source/20240619/63986D8440D4E5267A77ACD891CC4DE3.pdf; Supplier: LCSC; Applications Function: 收发器; Protocol: USB 2.0; Supply Voltage: 3.3V；5V; Data Rate: 2Mbps
U3 = STM32L051C8T6: CPU内核:ARM-M系列;CPU最大主频:32MHz;应用领域:-;; LCSC Part Name: 超低功耗Arm Cortex-M0+ MCU，具有64-KB Flash存储器和32 MHz CPU; Supplier Part: C110878; Manufacturer: ST(意法半导体); Supplier Footprint: LQFP-48(7x7); JLCPCB Part Class: 扩展库; Datasheet: https://atta.szlcsc.com/upload/public/pdf/source/20170810/C124724_1502335304342879861.pdf; Supplier: LCSC; CPU Core: ARM-M系列; CPU Maximum Speed: 32MHz; Program Storage Size: 64KB; Program Memory Type: FLASH; Number of I/O: 37; ADC (Bit): 12bit; Low Voltage Detection Threshold: 1.65V~3.6V
USB1 = TYPE-C 16PIN 2MD(073): 连接器类型:Type-C;标准:USB 3.1;公母:母;安装方式:卧贴;触点数量:16P;端口数量:1;额定电流 - 电源:5A;工作温度范围:-25℃~+85℃;; LCSC Part Name: Type-C 母 卧贴; Supplier Part: C2765186; Manufacturer: SHOU HAN(首韩); Supplier Footprint: SMD; Datasheet: https://atta.szlcsc.com/upload/public/pdf/source/20211123/39B17C16241EAC15C5E277BDA434118E.pdf; Supplier: LCSC; Connector Type: Type-C; Standard: USB 3.1; Gender: 母; Mounting Style: 卧贴; Number of Contacts: 16P; Number of Ports: 1; Current Rating - Power (Max): 5A; Operating Temperature Range: -25℃~+85℃; Rated Voltage (Max): 5V; Connect-Disconnect Life: 5千次; Core Colour: 黑色
X1 = X49SD8MSB2SI: 晶振类型:直插晶振;频率:8MHz;常温频差:±10ppm;外接负载电容:20pF;频率稳定度(全温):±30ppm;; LCSC Part Name: 8MHz ±10ppm 20pF; Supplier Part: C188205; Manufacturer: YXC(扬兴晶振); Supplier Footprint: HC-49S; JLCPCB Part Class: 扩展库; Datasheet: https://atta.szlcsc.com/upload/public/pdf/source/20210903/A997D130AE99CBB55D9024F9BE6DA174.pdf; Supplier: LCSC; Crystal Type: 直插晶振; Normal temperature Frequency Tolerance: ±10ppm; External load capacitor: 20pF; Frequency Stability(Full temperature range): ±30ppm; Operating Temperature: -40℃~+85℃
X2 = X308032768KGB2SC: 晶振类型:直插晶振;频率:32.768kHz;常温频差:±10ppm;外接负载电容:12.5pF;频率稳定度(全温):-;; LCSC Part Name: 32.768kHz ±10ppm 12.5pF YT-38; Supplier Part: C52082; Manufacturer: YXC(扬兴晶振); Supplier Footprint: DT-38; JLCPCB Part Class: 扩展库; Datasheet: https://atta.szlcsc.com/upload/public/pdf/source/20240329/231E1A1EB7C875CD193DBE6664A3DE3A.pdf; Supplier: LCSC; Crystal Type: 直插晶振; Normal temperature Frequency Tolerance: ±10ppm; External load capacitor: 12.5pF; Operating Temperature: -20℃~+70℃
删除人脸 取消操作 注册人脸 验证人脸 = TS-1002S-06026C: 电路结构:单刀单掷;按钮形状:圆形按钮;安装方式:立贴;开关长度:6mm;开关宽度:6mm;开关高度:6mm;触点电流:50mA;额定电压(DC):12V;带灯:-;机械寿命:-;; LCSC Part Name: 6*6*6mm 立贴 轻触开关; Supplier Part: C455112; Manufacturer: XUNPU(讯普); Supplier Footprint: SMD,6x6mm; Datasheet: https://atta.szlcsc.com/upload/public/pdf/source/20191118/C455126_F61E8FA1ED640FB1CE0B30B55DEB62E3.pdf; Supplier: LCSC; Circuit: 单刀单掷; Actuator Style: 圆形按钮; Mounting Style: 立贴; Switch Length: 6mm; Switch Width: 6mm; Switch Height: 6mm; Contact Current: 50mA; Voltage Rating (DC): 12V

## Nets
3V3: C1.1 C3.2 C5.1 C7.1 C8.1 C12.1 H1.1 H2.1 H3.2 R4.1 R5.2 R6.2 U1.2(VOUT(TAB)) U1.4(TAB) U2.4(V3) U2.16(VCC) U3.1(VDD) U3.9(VDDA) U3.24(VDD) U3.36(VDDIO2) U3.48(VDD)
7V4: C13.2 C14.2 F2.2 Q1.2(S) R7.2 R12.2 U4.3(VIN)
+5V: C2.1 D1.2(K) D2.2(K) P1.6 R2.2 U1.3(VIN)
GND: BAT1.2 C1.2 C2.2 C3.1 C4.2 C5.2 C6.2 C7.2 C8.2 C9.1 C10.2 C11.2 C12.2 C13.1 C14.1 C16.1 C17.1 CN1.4 CN1.5 CN1.6 FM255.1(-) H1.4 H2.3 H3.1 P1.5 POWER.1(K) Q2.2(E) R1.2 R3.2 R9.1 R11.1 R16.1 RESET.1 U1.1(ADJ(GND)) U2.1(GND) U3.8(VSSA) U3.23(VSS) U3.35(VSS) U3.44(BOOT0) U3.47(VSS) U4.1(GND) USB1.1(GND) USB1.12(GND) USB1.13(SHELL) USB1.14(SHELL) 删除人脸.1 删除人脸.2 取消操作.1 取消操作.2 注册人脸.1 注册人脸.2 验证人脸.1 验证人脸.2
VBUS: F1.2 USB1.2(VBUS) USB1.11(VBUS)
CH340_RXD: U2.3(RXD) U3.30(PA9)
CH340_TXD: U2.2(TXD) U3.31(PA10)
D_N: U2.6(D-) USB1.5(DN2) USB1.7(DN1)
D_P: U2.5(D+) USB1.6(DP1) USB1.8(DP2)
FM225_CTL: R15.2 U3.13(PA3)
FM225_RX: CN1.3 U3.21(PB10)
FM225_TX: CN1.2 U3.22(PB11)
FM225_VCC: CN1.1 Q1.3(D) R13.2
I2C_SCL: H3.3 R5.1 U3.26(PB13)
I2C_SDA: H3.4 R6.1 U3.27(PB14)
IO1: P2.2 U3.38(PA15)
IO2: P2.3 U3.33(PA12)
IO3: P2.4 U3.29(PA8)
IO4: P2.5 U3.28(PB15)
IO5: P2.6 U3.25(PB12)
IO6: P2.7 U3.19(PB1)
IO7: P2.8 U3.18(PB0)
KEY0: U3.14(PA4) 删除人脸.3 删除人脸.4
KEY1: U3.15(PA5) 取消操作.3 取消操作.4
KEY2: U3.17(PA7) 验证人脸.3 验证人脸.4
KEY3: U3.16(PA6) 注册人脸.3 注册人脸.4
LD2402_IO: H2.2 U3.32(PA11)
NRST: C9.2 R4.2 RESET.2 U3.7(NRST)
OSC32_IN: C10.1 U3.3(PC14-OSC32_IN) X2.1(OSC1)
OSC32_OUT: C11.1 U3.4(PC15-OSC32_OUT) X2.2(OSC2)
OSC_IN: C4.1 U3.5(PH0-OSC_IN) X1.2(OSC2)
OSC_OUT: C6.1 U3.6(PH1-OSC_OUT) X1.1(OSC1)
SWCLK: H1.3 U3.37(PA14)
SWDIO: H1.2 U3.34(PA13)
$1N6044: D1.1(A) F1.1
$1N8498: POWER.2(A) R2.1
$1N17322: R1.1 USB1.10(CC2)
$1N17376: R3.1 USB1.4(CC1)
$3N3216: BAT1.1 SW1.1
$3N3418: F2.1 SW1.2
$3N11108: R7.1 R9.2 U4.5(EN)
$3N11159: C15.2 L1.1 U4.2(SW)
$3N11163: C15.1 U4.6(BOOT)
$3N11430: C16.2 C17.2 D2.1(A) L1.2 R8.2
$3N11747: C18.2 R8.1 R10.2
$3N11772: C18.1 R10.1 R11.2 U4.4(FB)
$3N14838: P1.7 SPK1.2(-)
$3N14842: P1.8 SPK1.1(+)
$3N17578: Q1.1(G) R12.1 R14.2
$3N17579: FM255.2(+) R13.1
$3N17587: Q2.1(B) R15.1 R16.2
$3N24342: Q2.3(C) R14.1
$3N25498: BAT1.3 BAT1.4

Not connected (* = marked no-connect by the designer): H2 4* 5*; P1 1* 2* 3* 4*; P2 1*; SCREW1 1*; SCREW2 1*; SCREW3 1*; SCREW4 1*; SW1 3* 4* 5* 6*; U2 7(NC.)* 8(OUT#)* 9(CTS#)* 10(DSR#)* 11(RI#)* 12(DCD#)* 13(DTR#)* 14(RTS#)* 15(R232)*; U3 2(PC13)* 10(PA0)* 11(PA1)* 12(PA2)* 20(PB2)* 39(PB3)* 40(PB4)* 41(PB5)* 42(PB6)* 43(PB7)* 45(PB8)* 46(PB9)*; USB1 3(SBU2)* 9(SBU1)*

## Notes on the sheets
sheet 1
- 防电流倒灌
- USB转串口
- LDO
- TYPEC口
- 8M高速晶振
- RTC时钟
- SWD调试
- 复位电路
- MCU
- 功能按键
- I2C上拉电阻
sheet 2
- 7.4降压5V
- S
- D
- G
- 1 导通
  0 截止
- LD2402
- JQ8900-16P
- FM225
- OLED12864

# Board PCB1
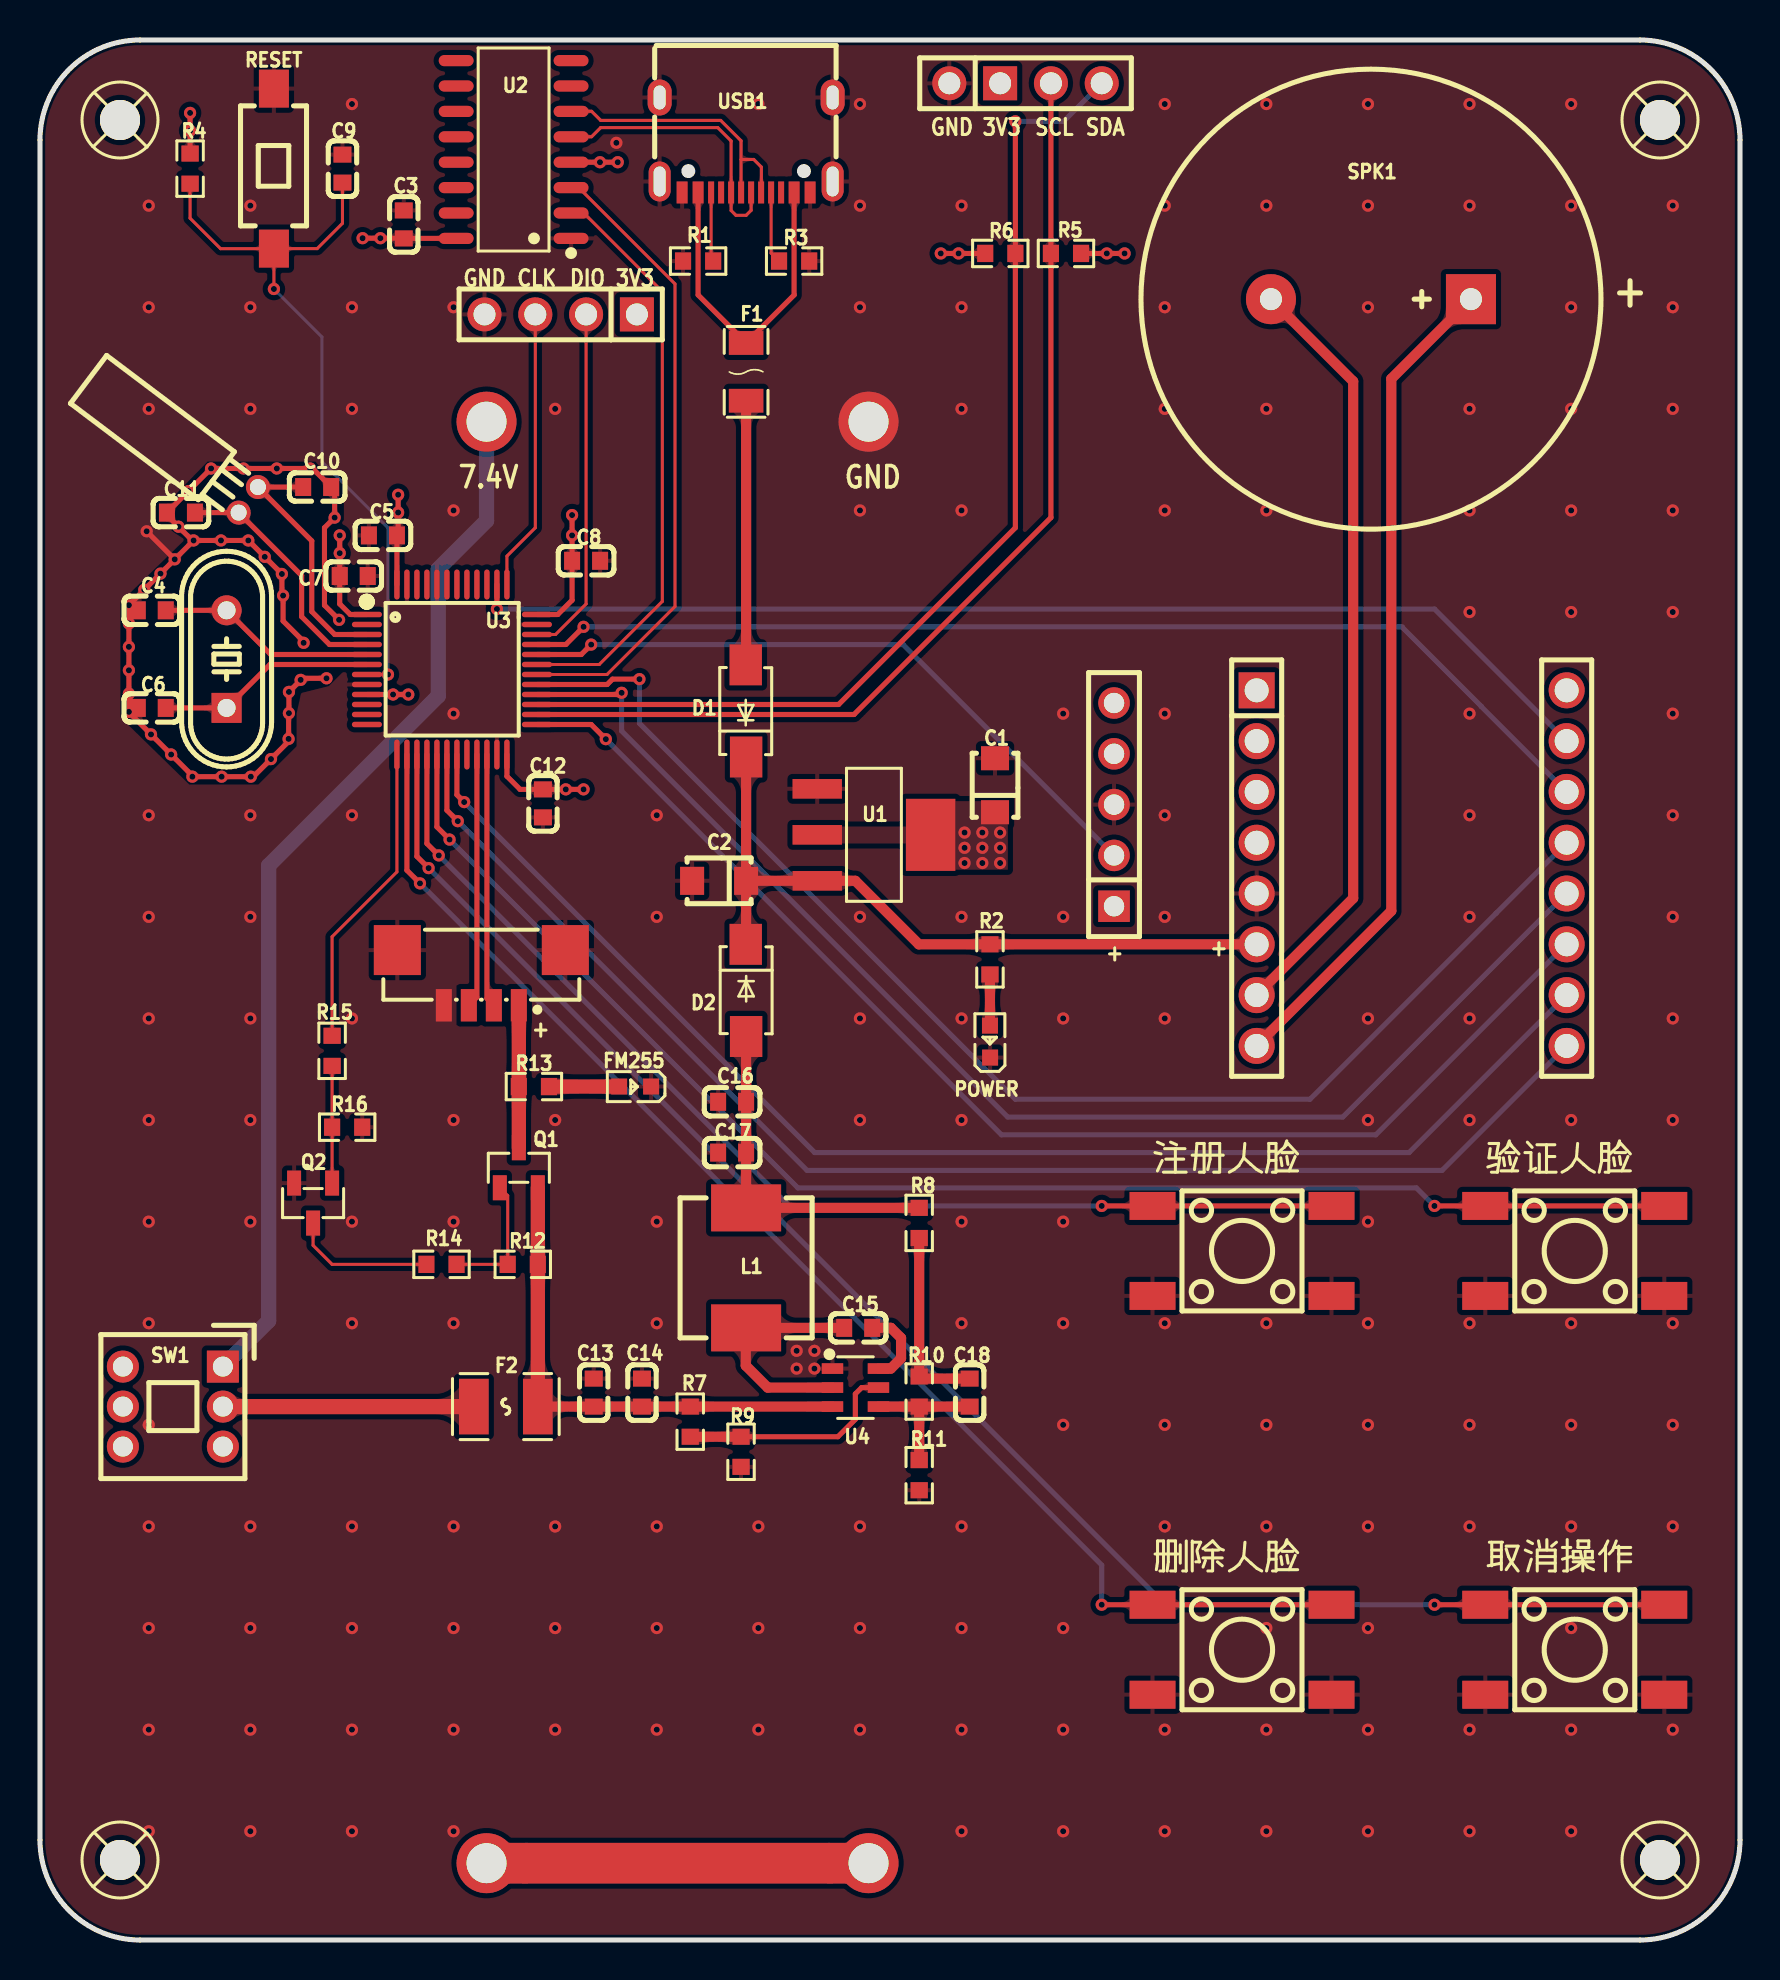
[diagram p2: board, top side]
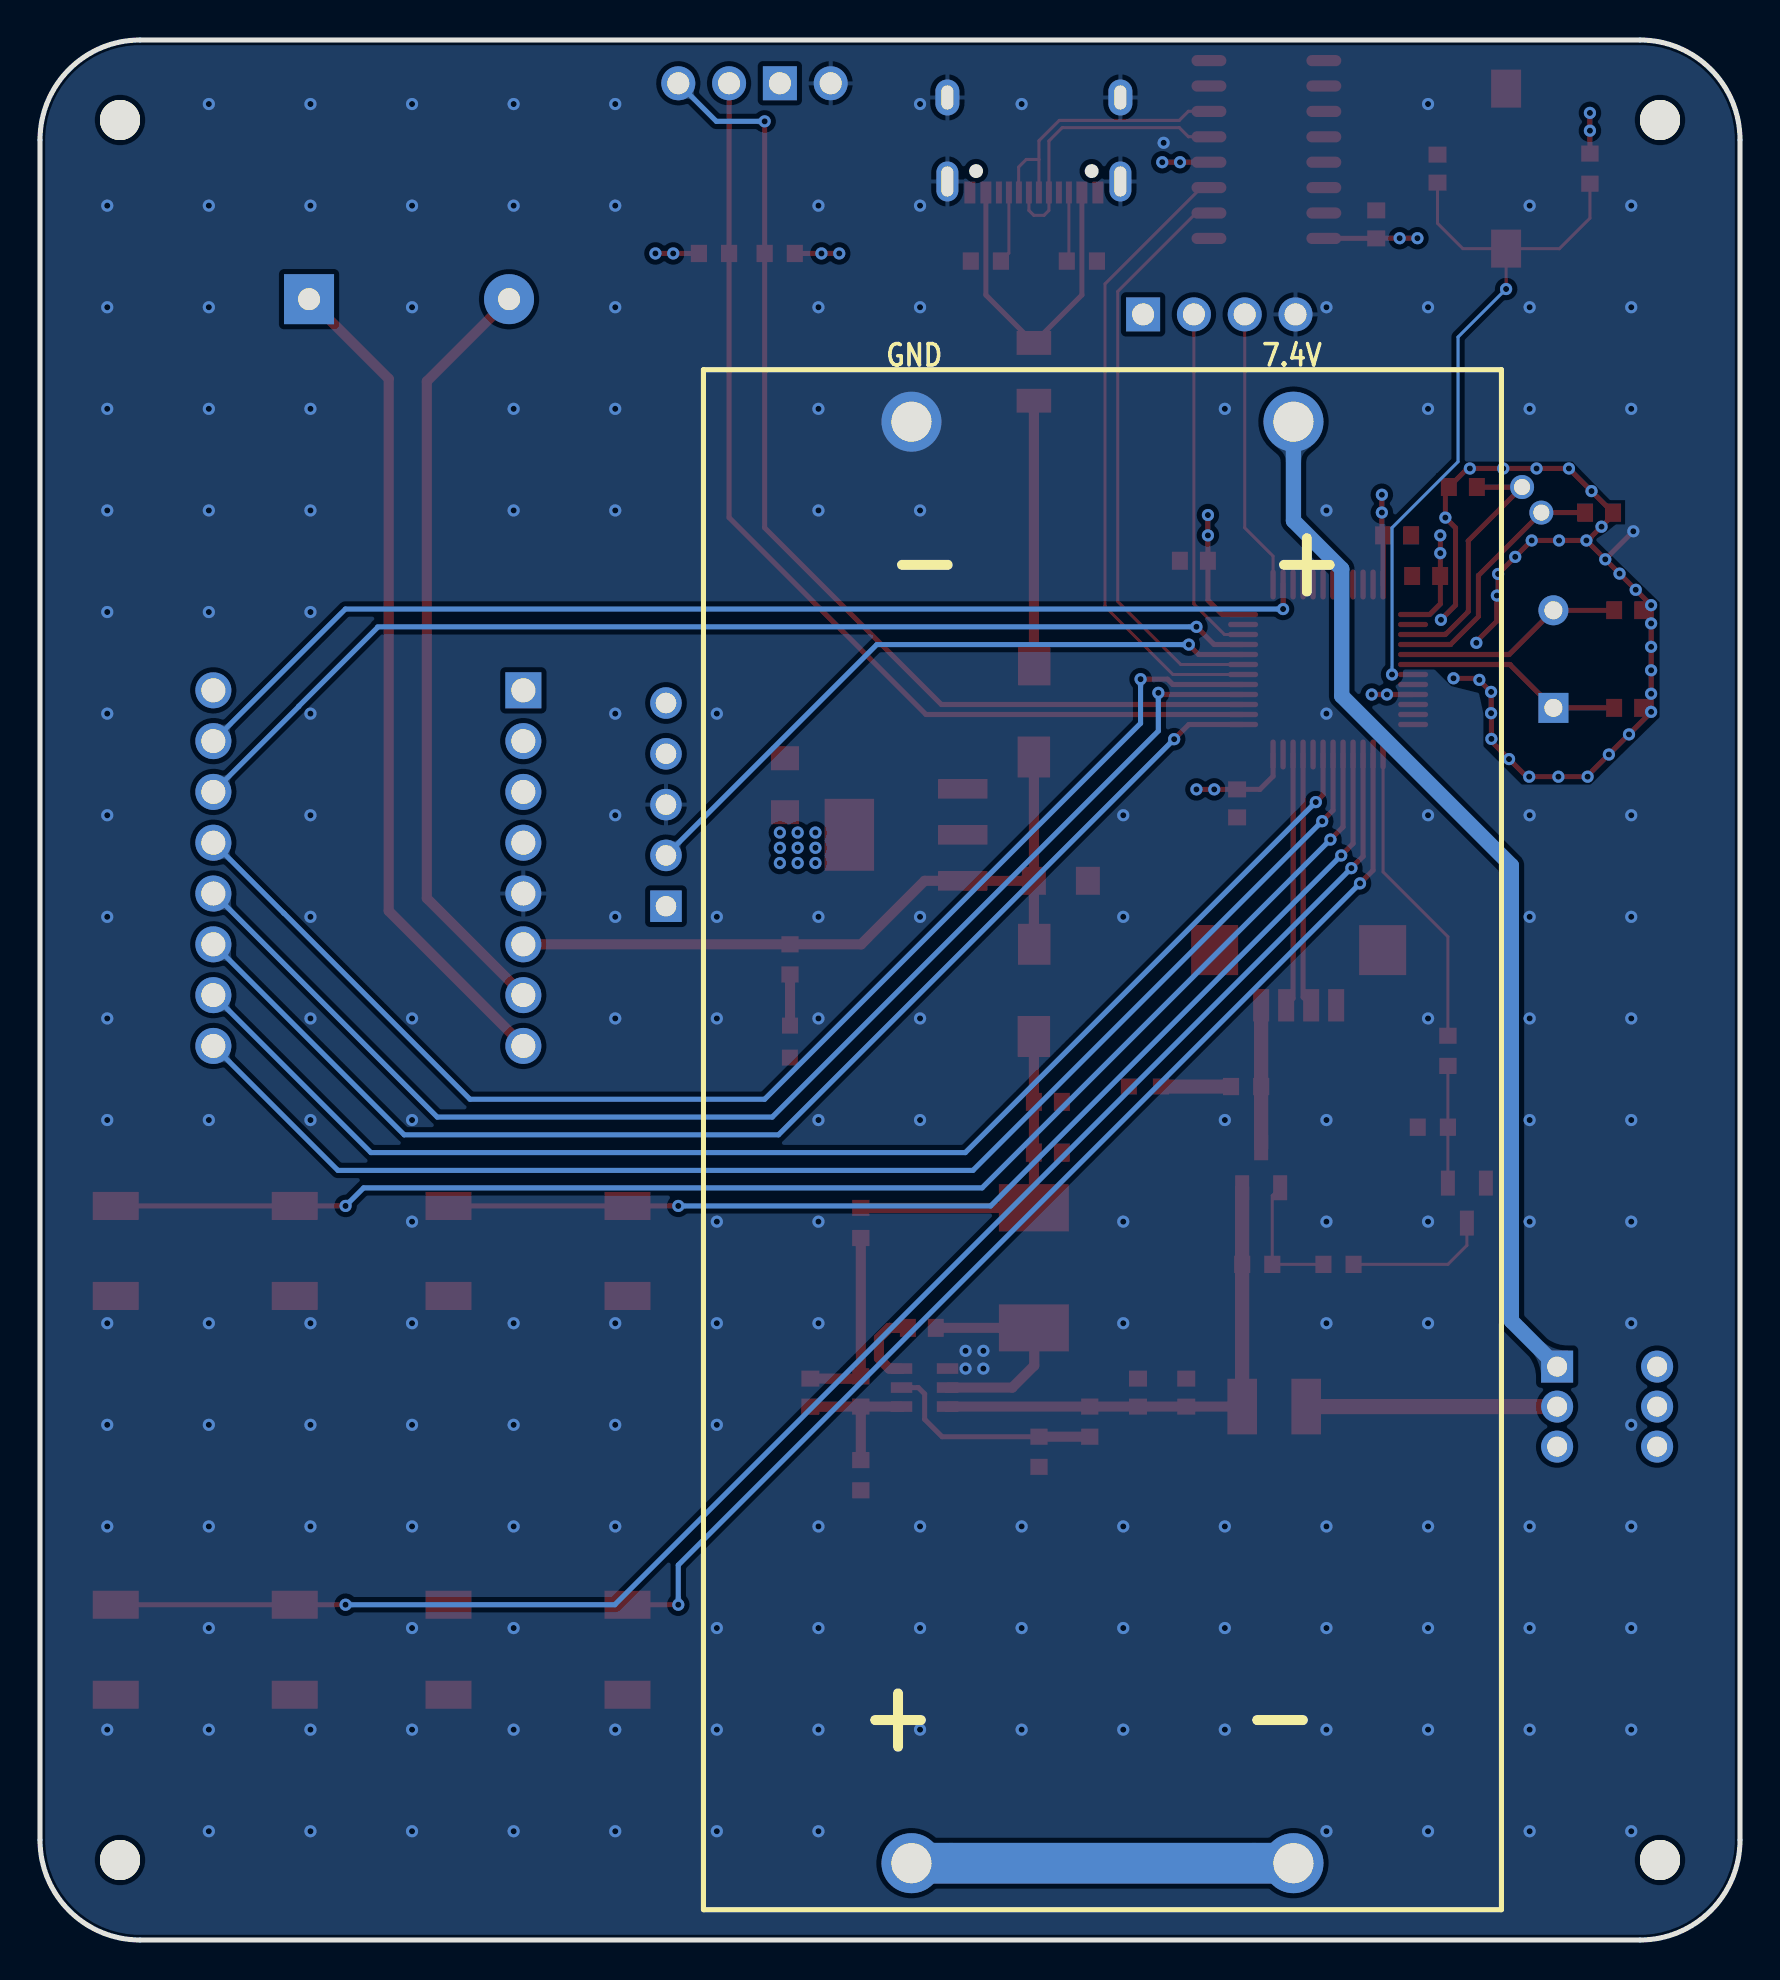
[diagram p3: board, bottom side, seen from below]

Outline 85 x 95 mm; copper layers: Top Layer, Inner1, Inner2, Bottom Layer. Coordinates in mm from the lower left corner of the outline.
Outline path: 0,90 arc(1.46,93.54) 5,95 80,95 arc(83.54,93.54) 85,90 85,5 arc(83.54,1.46) 80,0 5,0 arc(1.46,1.46) 0,5 0,90
Stack: Top Layer 0.035mm 外层铜厚1oz / Dielectric1 0.2104mm 7628 RC49% 8.6mil / Inner1 0.0152mm 内层铜厚 / Dielectric2 1.065mm 1.1mm H/HOZ Copper / Inner2 0.0152mm 内层铜厚 / Dielectric3 0.2104mm 7628 RC49% 8.6mil / Bottom Layer 0.035mm 外层铜厚1oz

## Design rules (mm)
net GND: PWR
net 3V3: PWR
net +5V: PWR
net $1N6044: PWR
net D_P: DP1
net D_N: DP1
template: JLCPCB Capability(Multiple Layers Board)
spacing copperThickness1oz (default): track to track 0.102, other pairs 0.152 to 0.3
spacing copperThickness2oz: track to track 0.203, other pairs 0.152 to 0.3
spacing copperThicknessInner0.5oz: track to track 0.089, other pairs 0.152 to 0.3
track width copperThickness1oz (default): min 0.102, default 0.254, max 2.54
track width copperThickness0.5oz: min 0.089, default 0.254, max 2.54
track width copperThickness2oz: min 0.203, default 0.254, max 2.54
differential pair differentialPair (default): width min 0.127, default 0.254, max 2.54; gap min 0.152, default 0.152
via viaSize (default): diameter min 0.3, default 0.61, max 10; hole min 0.2, default 0.305, max 6.3

## Placement (name value [footprint] x y rotation side)
BAT1  BH-18650-A1BJ021  [BAT-TH_L77.0-W39.9_BH-18650-A1BJ021]  31.88 39.88 270 bottom
C1  10uF  [CAP-SMD_L3.2-W1.6]  47.75 57.74 90 top
C2  10uF  [CAP-SMD_L3.2-W1.6]  33.96 52.96 180 top
C3  10uF  [C0603]  18.19 85.78 270 top
C4  20pF  [C0603]  5.59 66.48 180 top
C5  100nF  [C0603]  17.15 70.23 180 top
C6  20pF  [C0603]  5.59 61.61 180 top
C7  100nF  [C0603]  15.69 68.2 0 top
C8  100nF  [C0603]  27.31 68.96 0 top
C9  100nF  [C0603]  15.12 88.57 270 top
C10  12pF  [C0603]  13.86 72.65 0 top
C11  12pF  [C0603]  7.05 71.37 180 top
C12  100nF  [C0603]  25.15 56.83 270 top
C13  10uF  [C0603]  27.69 27.37 270 top
C14  100nF  [C0603]  30.1 27.37 270 top
C15  100nF  [C0603]  40.91 30.61 180 top
C16  22uF  [C0603]  34.61 41.91 0 top
C17  22uF  [C0603]  34.61 39.37 0 top
C18  75pF  [C0603]  46.48 27.37 90 top
CN1  HC-1.25-4PLT  [CONN-SMD_4P-P1.25_HCTL_HC-1.25-4PLT]  22.07 48.12 180 top
D1  SS54  [SMA_L4.3-W2.6-LS5.0-FD]  35.3 61.45 270 top
D2  SS54  [SMA_L4.3-W2.6-LS5.0-FD]  35.3 47.48 90 top
F1  JK-nSMD050-30  [F1206]  35.31 78.41 90 top
F2  BSMD1210-150-16V  [F1210]  23.29 26.67 0 top
FM255  NCD0603W3  [LED0603-RD]  29.76 42.67 180 top
H1  PZ254V-11-04P  [HDR-TH_4P-P2.54-V-M]  26.03 81.28 180 top
H2  2.54-1*5P母  [HDR-TH_5P-P2.54-V-F]  53.7 56.77 90 top
H3  2.54-1*4P母  [HDR-TH_4P-P2.54-V-F]  49.28 92.84 0 top
L1  10uH  [IND-SMD_L7.3-W6.8]  35.31 33.61 90 top
P1  2.54-1*8P母环保  [HDR-TH_8P-P2.54-V-F-1]  60.83 53.59 270 top
P2  2.54-1*8P母环保  [HDR-TH_8P-P2.54-V-F-1#2]  76.33 53.59 270 top
POWER  NCD0603R1  [LED0603-RD_RED]  47.5 44.92 90 top
Q1  SI2301  [SOT-23-3_L2.9-W1.3-P1.90-LS2.4-BR]  23.94 38.61 270 top
Q2  S8050  [SOT-23-3_L2.9-W1.3-P1.90-LS2.4-BR]  13.66 36.85 90 top
R1  5.1kΩ  [R0603]  32.91 83.95 180 top
R2  1kΩ  [R0603]  47.5 49.03 90 top
R3  5.1kΩ  [R0603]  37.71 83.95 0 top
R4  10kΩ  [R0603]  7.5 88.57 270 top
R5  4.7kΩ  [R0603]  51.3 84.33 0 top
R6  4.7kΩ  [R0603]  48.01 84.33 180 top
R7  510kΩ  [R0603]  32.51 25.92 90 top
R8  49.9Ω  [R0603]  43.96 35.85 90 top
R9  100kΩ  [R0603]  35.05 24.41 90 top
R10  100kΩ  [R0603]  43.96 27.42 90 top
R11  13.3kΩ  [R0603]  43.96 23.24 90 top
R12  100kΩ  [R0603]  24.14 33.78 0 top
R13  2.2kΩ  [R0603]  24.7 42.67 180 top
R14  100Ω  [R0603]  20.07 33.78 0 top
R15  10kΩ  [R0603]  14.61 44.46 90 top
R16  10kΩ  [R0603]  15.36 40.64 180 top
RESET  TS-1101-C-W  [SW-SMD_L6.0-W3.3-LS8.0]  11.69 88.57 270 top
SCREW1  -  [M2螺丝]  4 91 0 top
SCREW2  -  [M2螺丝]  81 91 0 top
SCREW3  -  [M2螺丝]  4 4 0 top
SCREW4  -  [M2螺丝]  81 4 0 top
SPK1  GSPK2307P-8R1W  [SPK-TH_BD23.0-P10.00-D0.8-L-RD]  66.55 82.04 180 top
SW1  XKB7070-Z  [SW-TH_6P-L7.0-W7.0-P2.00]  6.64 26.67 0 top
U1  AMS1117-3.3  [SOT-223-4_L6.5-W3.5-P2.30-LS7.0-BR]  41.7 55.26 180 top
U2  CH340C  [SOP-16_L10.0-W3.9-P1.27-LS6.0-BL]  23.68 89.52 90 top
U3  STM32L051C8T6  [LQFP-48_L7.0-W7.0-P0.50-LS9.0-BL]  20.6 63.53 270 top
U4  TPS54302DDCR  [SOT-23-6_L2.9-W1.6-P0.95-LS2.8-BL]  40.77 27.62 270 top
USB1  TYPE-C 16PIN 2MD(073)  [USB-C-SMD_TYPE-C-6PIN-2MD-073]  35.31 89.75 180 top
X1  8MHz  [HC-49US_L11.5-W4.5-P4.88]  9.33 64.05 90 top
X2  32.768kHz  [OSC-TH_BD3.1-P0.8-D0.3]  10.41 72.01 323 top
删除人脸  TS-1002S-06026C  [KEY-SMD_4P-L6.0-W6.0-P4.50-LS9.5-BR]  60.1 14.51 0 top
取消操作  TS-1002S-06026C  [KEY-SMD_4P-L6.0-W6.0-P4.50-LS9.5-BR]  76.74 14.51 0 top
注册人脸  TS-1002S-06026C  [KEY-SMD_4P-L6.0-W6.0-P4.50-LS9.5-BR]  60.1 34.45 0 top
验证人脸  TS-1002S-06026C  [KEY-SMD_4P-L6.0-W6.0-P4.50-LS9.5-BR]  76.74 34.45 0 top

## Footprints (pads in the part's own frame, mm; a bottom-side part is the same pattern mirrored in y, then rotated)
BAT-TH_L77.0-W39.9_BH-18650-A1BJ021
  round 3 hole 2: 1(-36.038,9.55) 2(-36.038,-9.55) 3(36.038,-9.55) 4(36.038,9.55)
C0603
  rect 0.8x0.9 smd: 1(-0.7,0) 2(0.7,0)
CAP-SMD_L3.2-W1.6
  rect 1.2x1.4 smd: 1(-1.35,0) 2(1.35,0)
CONN-SMD_4P-P1.25_HCTL_HC-1.25-4PLT
  rect 0.8x1.62 smd: 1(-1.875,1.38) 2(-0.625,1.38) 3(0.625,1.38) 4(1.875,1.38)
  rect 2.35x2.5 smd: 5(-4.2,-1.38) 6(4.2,-1.38)
F1206
  rect 1.19x1.728 smd: 1(-1.445,0) 2(1.445,0)
F1210
  rect 1.485x2.781 smd: 1(-1.6,0) 2(1.6,0)
HC-49US_L11.5-W4.5-P4.88
  rect 1.5x1.5 hole 0.9: 1(-2.44,0)
  round 1.5 hole 0.9: 2(2.44,0)
HDR-TH_4P-P2.54-V-F
  round 1.7 hole 1.1: 1(-3.81,0) 3(1.27,0) 4(3.81,0)
  rect 1.7x1.7 hole 1.1: 2(-1.27,0)
HDR-TH_4P-P2.54-V-M
  rect 1.7x1.7 hole 1.1: 1(-3.81,0)
  round 1.7 hole 1.1: 2(-1.27,0) 3(1.27,0) 4(3.81,0)
HDR-TH_5P-P2.54-V-F
  rect 1.575x1.575 hole 1.02: 1(-5.08,0)
  round 1.575 hole 1.02: 2(-2.54,0) 3(0,0) 4(2.54,0) 5(5.08,0)
HDR-TH_8P-P2.54-V-F-1
  rect 1.8x1.8 hole 1.2: 1(-8.89,0)
  round 1.8 hole 1.2: 2(-6.35,0) 3(-3.81,0) 4(-1.27,0) 5(1.27,0) 6(3.81,0) 7(6.35,0) 8(8.89,0)
HDR-TH_8P-P2.54-V-F-1#2
  round 1.8 hole 1.2: 1(-8.89,0) 2(-6.35,0) 3(-3.81,0) 4(-1.27,0) 5(1.27,0) 6(3.81,0) 7(6.35,0) 8(8.89,0)
IND-SMD_L7.3-W6.8
  rect 2.35x3.5 smd: 1(-3,0) 2(3,0)
KEY-SMD_4P-L6.0-W6.0-P4.50-LS9.5-BR
  rect 2.3x1.4 smd: 1(4.475,-2.25) 2(-4.475,-2.25) 3(4.475,2.25) 4(-4.475,2.25)
LED0603-RD
  rect 0.8x0.8 smd: 1(-0.799,0) 2(0.799,0)
LED0603-RD_RED
  rect 0.8x0.8 smd: 1(-0.799,-0.004) 2(0.799,0.004)
LQFP-48_L7.0-W7.0-P0.50-LS9.0-BL
  oval 0.27x1.5 smd: 1(-2.75,-4.25) 2(-2.25,-4.25) 3(-1.75,-4.25) 4(-1.25,-4.25) 5(-0.75,-4.25) 6(-0.25,-4.25) 7(0.25,-4.25) 8(0.75,-4.25) 9(1.25,-4.25) 10(1.75,-4.25) 11(2.25,-4.25) 12(2.75,-4.25) 25(2.75,4.25) 26(2.25,4.25) 27(1.75,4.25) 28(1.25,4.25) 29(0.75,4.25) 30(0.25,4.25) 31(-0.25,4.25) 32(-0.75,4.25) 33(-1.25,4.25) 34(-1.75,4.25) 35(-2.25,4.25) 36(-2.75,4.25)
  oval 1.5x0.27 smd: 13(4.25,-2.75) 14(4.25,-2.25) 15(4.25,-1.75) 16(4.25,-1.25) 17(4.25,-0.75) 18(4.25,-0.25) 19(4.25,0.25) 20(4.25,0.75) 21(4.25,1.25) 22(4.25,1.75) 23(4.25,2.25) 24(4.25,2.75) 37(-4.25,2.75) 38(-4.25,2.25) 39(-4.25,1.75) 40(-4.25,1.25) 41(-4.25,0.75) 42(-4.25,0.25) 43(-4.25,-0.25) 44(-4.25,-0.75) 45(-4.25,-1.25) 46(-4.25,-1.75) 47(-4.25,-2.25) 48(-4.25,-2.75)
M2螺丝
  round 2 hole 2: 1(0,0)
OSC-TH_BD3.1-P0.8-D0.3
  round 1.2 hole 0.8: 1(0,0.8) 2(0,-0.8)
R0603
  rect 0.806x0.864 smd: 1(-0.753,0) 2(0.753,0)
SMA_L4.3-W2.6-LS5.0-FD
  rect 2.046x1.62 smd: 1(-2.304,-0.009) 2(2.304,0.009)
SOP-16_L10.0-W3.9-P1.27-LS6.0-BL
  oval 0.56x1.745 smd: 1(-4.445,-2.873) 2(-3.175,-2.873) 3(-1.905,-2.873) 4(-0.635,-2.873) 5(0.635,-2.873) 6(1.905,-2.873) 7(3.175,-2.873) 8(4.445,-2.873) 9(4.445,2.873) 10(3.175,2.873) 11(1.905,2.873) 12(0.635,2.873) 13(-0.635,2.873) 14(-1.905,2.873) 15(-3.175,2.873) 16(-4.445,2.873)
SOT-23-3_L2.9-W1.3-P1.90-LS2.4-BR
  rect 1.25x0.7 smd: 1(1,-0.95) 2(1,0.95) 3(-1,0)
SOT-23-6_L2.9-W1.6-P0.95-LS2.8-BL
  rect 0.532x1.072 smd: 1(-0.95,-1.149) 2(0,-1.149) 3(0.95,-1.149) 4(0.95,1.149) 5(0,1.149) 6(-0.95,1.149)
SOT-223-4_L6.5-W3.5-P2.30-LS7.0-BR
  rect 2.47x0.98 smd: 1(2.835,-2.3) 2(2.835,0) 3(2.835,2.3)
  rect 2.47x3.6 smd: 4(-2.835,0)
SPK-TH_BD23.0-P10.00-D0.8-L-RD
  rect 2.5x2.5 hole 1.1: 1(-5,0)
  round 2.5 hole 1.1: 2(5,0)
SW-SMD_L6.0-W3.3-LS8.0
  rect 1.9x1.5 smd: 1(-4,0) 2(4,0)
SW-TH_6P-L7.0-W7.0-P2.00
  rect 1.6x1.6 hole 1: 1(2.499,2)
  round 1.6 hole 1: 2(2.5,0) 3(2.5,-2) 4(-2.5,2) 5(-2.5,0) 6(-2.5,-2)
USB-C-SMD_TYPE-C-6PIN-2MD-073
  rect 0.55x1.1 smd: 1(-3.2,2.375) 2(-2.4,2.375) 11(2.4,2.375) 12(3.2,2.375)
  rect 0.3x1.1 smd: 3(-1.75,2.375) 4(-1.25,2.375) 5(-0.75,2.375) 6(-0.25,2.375) 7(0.25,2.375) 8(0.75,2.375) 9(1.25,2.375) 10(1.75,2.375)
  oval 1.1x2 hole 0.6x1.5: 13(-4.325,1.825) 14(4.325,1.825)
  oval 1.2x1.8 hole 0.6x1.2: 13(-4.325,-2.375) 14(4.325,-2.375)

## Nets
As in the schematic.

Pads without a net: H2 4 5; P1 1 2 3 4; P2 1; SCREW1 1; SCREW2 1; SCREW3 1; SCREW4 1; SW1 3 4 5 6; U2 7 8 9 10 11 12 13 14 15; U3 2 10 11 12 20 39 40 41 42 43 45 46; USB1 3 9

## Via types
v1: diameter 0.61, hole 0.305, Top Layer to Bottom Layer, 262 vias

## Routing (per net, layer and track width the routed paths; a pad name or vN(x,y) marks a point on that pad's centre or on a via; arc(x,y) is an arc through that point)
3V3: length 36.4
  Top Layer w0.254: U2.4 v1(28,88.89) v1(28.89,88.89) ; v1(14.99,70.23) v1(14.99,69.34) C7.1 14.99,66.8 15.51,66.28 U3.1 ; 26.6,68.96 26.6,66.99 25.89,66.28 U3.36 ; 26.6,68.96 v1(26.6,70.23) v1(26.6,71.25) ; v1(7.5,91.35) v1(7.5,90.47) R4.1 ; 20.81,85.08 C3.2 18.18,85.09 v1(17.02,85.09) v1(16.13,85.09) ; v1(45.93,84.33) 47.26,84.33 ; U3.48 C5.1 17.91,70.29 v1(17.91,71.37) v1(17.91,72.26) ; v1(18.41,62.28) v1(17.65,62.28) U3.9 ; R5.2 v1(53.34,84.33) v1(54.23,84.33) ; v1(27.18,57.53) v1(26.29,57.53) C12.1 24,57.53 23.35,58.19 U3.24 ; 45.8,84.33 v1(45.04,84.33)
  vias: v1(46.23,55.37) v1(46.23,54.61) v1(46.23,53.85) v1(47.12,55.37) v1(47.12,54.61) v1(47.12,53.85) v1(48.01,55.37) v1(48.01,54.61) v1(48.01,53.85)
7V4: length 25.7
  Top Layer w0.508: F2.2 C13.2 C14.2 R7.2 U4.3
  Top Layer w0.711: Q1.2 R12.2 F2.2
+5V: length 36.2
  Top Layer w0.508: D1.2 C2.1 ; C2.1 35.31,49.8 D2.2 ; C2.1 U1.3 40.77,52.96 43.94,49.78 R2.2 P1.6
GND: length 54.3
  Top Layer w0.254: 13.49,73.58 v1(11.84,73.58) v1(10.17,73.58) v1(8.55,73.58) v1(7.42,72.45) C11.2 6.35,71.24 v1(6.92,70.67) 7.61,69.98 v1(7.68,69.98) ; v1(6.74,69.03) v1(6.02,68.32) v1(5.21,67.51) v1(4.44,66.74) v1(4.44,65.83) v1(4.44,62.31) 4.44,61.39 v1(5.55,60.28) v1(6.56,59.27) 7.62,58.21 v1(7.62,58.17) v1(9.08,58.17) v1(10.54,58.17) 10.67,58.17 v1(11.55,59.05) 12.43,59.93 v1(12.43,60.06) 12.43,61.33 v1(12.45,61.34) v1(12.45,62.4) 13.03,62.99 v1(13.03,63.01) 13.11,63.08 v1(14.33,63.08) ; v1(6.74,69.03) v1(7.68,69.98) ; v1(6.74,69.03) v1(5.33,70.44) ; v1(7.68,69.98) v1(9.05,69.98) v1(10.41,69.98) 10.42,69.98 v1(11.24,69.16) v1(12.09,68.3) 12.09,67.28 v1(12.16,67.22) 12.16,65.95 13.18,64.92 v1(13.18,64.86) ; v1(14.95,66.01) 14.22,66.74 14.22,70.61 v1(14.73,71.12) 14.73,72.47 C10.2 13.63,73.58 v1(13.51,73.58)
  vias: v1(4.44,64.66) v1(4.44,63.49) v1(4.44,61.41) v1(5.44,86.72) v1(5.44,81.64) v1(5.44,76.56) v1(5.44,56.24) v1(5.44,51.16) v1(5.44,46.08) v1(5.44,41) v1(5.44,35.92) v1(5.44,30.84) v1(5.44,25.76) v1(5.44,20.68) v1(5.44,15.6) v1(5.44,10.52) v1(5.44,5.44) v1(10.52,86.72) v1(10.52,81.64) v1(10.52,76.56) v1(10.52,56.24) v1(10.52,51.16) v1(10.52,46.08) v1(10.52,41) v1(10.52,35.92) v1(10.52,20.68) v1(10.52,15.6) v1(10.52,10.52) v1(10.52,5.44) v1(15.6,91.8) v1(15.6,81.64) v1(15.6,76.56) v1(15.6,56.24) v1(15.6,46.08) v1(15.6,35.92) v1(15.6,30.84) v1(15.6,20.68) v1(15.6,15.6) v1(15.6,10.52) v1(15.6,5.44) v1(20.68,81.64) v1(20.68,71.48) v1(20.68,61.32) v1(20.68,41) v1(20.68,35.92) v1(20.68,30.84) v1(20.68,20.68) v1(20.68,15.6) v1(20.68,10.52) v1(20.68,5.44) v1(25.76,76.56) v1(25.76,41) v1(25.76,20.68) v1(25.76,15.6) v1(25.76,10.52) v1(28.82,89.86) v1(30.84,56.24) v1(30.84,51.16) v1(30.84,35.92) v1(30.84,30.84) v1(30.84,20.68) v1(30.84,15.6) v1(30.84,10.52) v1(35.92,91.8) v1(35.92,20.68) v1(35.92,15.6) v1(35.92,10.52) v1(37.83,29.46) v1(37.83,28.57) v1(38.72,29.46) v1(38.72,28.57) v1(41,91.8) v1(41,86.72) v1(41,81.64) v1(41,71.48) v1(41,51.16) v1(41,46.08) v1(41,41) v1(41,20.68) v1(41,15.6) v1(41,10.52) v1(46.08,86.72) v1(46.08,81.64) v1(46.08,76.56) v1(46.08,71.48) v1(46.08,51.16) v1(46.08,46.08) v1(46.08,41) v1(46.08,35.92) v1(46.08,30.84) v1(46.08,20.68) v1(46.08,15.6) v1(46.08,10.52) v1(46.08,5.44) v1(51.16,61.32) v1(51.16,51.16) v1(51.16,46.08) v1(51.16,35.92) v1(51.16,30.84) v1(51.16,25.76) v1(51.16,15.6) v1(51.16,10.52) v1(51.16,5.44) v1(56.24,91.8) v1(56.24,86.72) v1(56.24,81.64) v1(56.24,76.56) v1(56.24,71.48) v1(56.24,61.32) v1(56.24,56.24) v1(56.24,51.16) v1(56.24,46.08) v1(56.24,30.84) v1(56.24,25.76) v1(56.24,20.68) v1(56.24,10.52) v1(56.24,5.44) v1(61.32,91.8) v1(61.32,86.72) v1(61.32,76.56) v1(61.32,71.48) v1(61.32,30.84) v1(61.32,25.76) v1(61.32,20.68) v1(61.32,15.6) v1(61.32,10.52) v1(61.32,5.44) v1(66.4,91.8) v1(66.4,86.72) v1(66.4,81.64) v1(66.4,46.08) v1(66.4,41) v1(66.4,35.92) v1(66.4,30.84) v1(66.4,25.76) v1(66.4,20.68) v1(66.4,15.6) v1(66.4,10.52) v1(66.4,5.44) v1(71.48,91.8) v1(71.48,86.72) v1(71.48,76.56) v1(71.48,71.48) v1(71.48,66.4) v1(71.48,61.32) v1(71.48,56.24) v1(71.48,51.16) v1(71.48,46.08) v1(71.48,41) v1(71.48,30.84) v1(71.48,25.76) v1(71.48,20.68) v1(71.48,10.52) v1(71.48,5.44) v1(76.56,91.8) v1(76.56,86.72) v1(76.56,81.64) v1(76.56,76.56) v1(76.56,71.48) v1(76.56,66.4) v1(76.56,41) v1(76.56,30.84) v1(76.56,25.76) v1(76.56,20.68) v1(76.56,15.6) v1(76.56,10.52) v1(76.56,5.44) v1(81.64,86.72) v1(81.64,81.64) v1(81.64,76.56) v1(81.64,71.48) v1(81.64,66.4) v1(81.64,61.32) v1(81.64,56.24) v1(81.64,51.16) v1(81.64,46.08) v1(81.64,41) v1(81.64,30.84) v1(81.64,25.76) v1(81.64,20.68) v1(81.64,10.52)
VBUS: length 17
  Top Layer w0.254: USB1.11 32.91,82.25 F1.2 37.71,82.25 USB1.2
CH340_RXD: length 31.6
  Top Layer w0.152: U2.3 26.94,87.62 31.75,82.8 31.75,66.67 28.35,63.28 U3.30
CH340_TXD: length 29.3
  Top Layer w0.152: U3.31 27.96,63.78 31.12,66.93 31.12,82.42 27.19,86.35 26.55,86.35
D_N: length 14.1
  Top Layer w0.155: 26.55,91.43 27.58,91.43 28.04,90.98 34.04,90.98 35.05,89.96 35.05,89.03 ; 35.06,87.41 35.05,87.42 35.05,89.03 ; 36.07,87.43 36.07,88.65 35.69,89.03 35.05,89.03
D_P: length 14.1
  Top Layer w0.155: 35.56,87.41 35.56,86.48 35.31,86.23 34.8,86.23 34.56,86.47 USB1.8 34.56,89.95 33.89,90.62 28.04,90.62 27.58,90.16 26.55,90.16
FM225_CTL: length 15.4
  Top Layer w0.152: R15.2 14.61,50.17 17.85,53.41 U3.13
FM225_RX: length 12.7
  Top Layer w0.254: CN1.3 21.85,47.14 U3.21
FM225_TX: length 12.7
  Top Layer w0.254: CN1.2 22.35,47.08 U3.22
FM225_VCC: length 7.1
  Top Layer w0.711: Q1.3 R13.2 CN1.1
I2C_SCL: length 51.5
  Top Layer w0.254: U3.26 40.7,61.28 50.55,71.12 R5.1 H3.3
I2C_SDA: length 53
  Top Layer w0.254: v1(48.77,90.93) R6.1 48.77,70.61 39.93,61.78 U3.27
  Bottom Layer w0.254: v1(48.77,90.93) 51.18,90.93 H3.4
IO1: length 57.4
  Top Layer w0.254: U3.38 v1(22.85,66.55)
  Bottom Layer w0.254: v1(22.85,66.55) 69.73,66.55 P2.2
IO2: length 55.3
  Top Layer w0.254: v1(27.18,65.66) 26.29,64.78 U3.33
  Bottom Layer w0.254: v1(27.18,65.66) 68.12,65.66 ; 68.12,65.63 72.06,61.69 72.06,61.67 P2.3
IO3: length 66.9
  Top Layer w0.254: U3.29 28.36,62.78 28.63,63.04 v1(29.97,63.04)
  Bottom Layer w0.254: P2.4 72.81,51.34 72.8,51.34 63.5,42.04 48.77,42.04 29.97,60.83 v1(29.97,63.04)
IO4: length 66.1
  Top Layer w0.254: v1(29.08,62.36) 29,62.28 U3.28
  Bottom Layer w0.254: 76.33,52.34 65.14,41.15 48.39,41.15 29.08,60.45 v1(29.08,62.36)
IO5: length 63.9
  Top Layer w0.254: U3.25 27.56,60.78 v1(28.29,60.04)
  Bottom Layer w0.254: 76.33,49.8 66.79,40.26 48.07,40.26 v1(28.29,60.04)
IO6: length 68.2
  Top Layer w0.254: v1(21.21,56.9) 20.85,57.26 U3.19
  Bottom Layer w0.254: 76.33,47.26 76.33,47.25 68.45,39.37 38.74,39.37 v1(21.21,56.9)
IO7: length 68.8
  Top Layer w0.254: v1(20.89,55.94) 20.35,56.49 U3.18
  Bottom Layer w0.254: 76.33,44.72 76.33,44.71 70.1,38.48 38.35,38.48 v1(20.89,55.94)
KEY0: length 68.4
  Top Layer w0.254: 删除人脸.3 删除人脸.4 v1(53.09,16.76) ; U3.14 18.35,53.48 v1(19,52.83)
  Bottom Layer w0.254: v1(19,52.83) 53.09,18.75 v1(53.09,16.76)
KEY1: length 83
  Top Layer w0.254: v1(19.43,53.59) 18.85,54.18 U3.15 ; v1(69.72,16.76) 取消操作.4 取消操作.3
  Bottom Layer w0.254: v1(69.72,16.76) 56.26,16.76 v1(19.43,53.59)
KEY2: length 72.8
  Top Layer w0.254: U3.17 19.85,55.65 v1(20.48,55.02) ; v1(69.72,36.7) 验证人脸.4 验证人脸.3
  Bottom Layer w0.254: v1(20.48,55.02) 37.9,37.61 68.82,37.61 v1(69.72,36.7)
KEY3: length 57.2
  Top Layer w0.254: v1(53.09,36.7) 注册人脸.4 注册人脸.3 ; U3.16 19.35,54.82 v1(19.94,54.23)
  Bottom Layer w0.254: v1(53.09,36.7) 37.47,36.7 v1(19.94,54.23)
LD2402_IO: length 33.4
  Top Layer w0.254: U3.32 27.06,64.28 v1(27.56,64.77)
  Bottom Layer w0.254: v1(27.56,64.77) 43.16,64.77 H2.2
NRST: length 37.2
  Top Layer w0.152: RESET.2 13.86,84.57 15.12,85.84 C9.2 ; RESET.2 11.69,84.57 9.03,84.57 7.5,86.09 R4.2 ; RESET.2 v1(11.69,82.55) ; U3.7 v1(17.4,63.28)
  Bottom Layer w0.152: v1(17.4,63.28) 17.4,70.61 14.1,73.91 14.1,80.15 v1(11.69,82.55)
OSC32_IN: length 12.8
  Top Layer w0.254: U3.3 14.73,65.28 13.59,66.42 13.59,69.95 X2.1 13.16,72.65
OSC32_OUT: length 12.5
  Top Layer w0.254: 7.75,71.37 X2.2 13.08,68.23 13.08,68.23 13.08,66.17 14.47,64.78 U3.4
OSC_IN: length 11
  Top Layer w0.254: U3.5 11.54,64.28 X1.2 C4.1
OSC_OUT: length 11
  Top Layer w0.254: U3.6 11.5,63.78 X1.1 C6.1
SWCLK: length 14.1
  Top Layer w0.152: U3.37 23.35,69.19 24.76,70.61 H1.3
SWDIO: length 17.1
  Top Layer w0.152: H1.2 27.31,66.8 25.78,65.28 25.35,65.28
$1N6044: length 13.2
  Top Layer w0.508: F1.1 35.31,63.76
$1N8498: length 2.6
  Top Layer w0.508: 47.5,48.28 POWER.2
$1N17322: length 3.5
  Top Layer w0.152: USB1.10 33.56,84.05 R1.1
$1N17376: length 3.6
  Top Layer w0.152: R3.1 36.56,84.34 USB1.4
$3N3216: length 52.7
  Bottom Layer w0.762: BAT1.1 22.33,70.96 19.91,68.55 19.91,62.2 11.43,53.72 11.43,30.96 SW1.1
$3N3418: length 12.5
  Top Layer w0.762: SW1.2 F2.1
$3N11108: length 11.2
  Top Layer w0.254: R9.2 39.9,25.16 40.77,26.03 40.77,27.31 41.08,27.62 U4.5
  Top Layer w0.508: R7.1 R9.2
$3N11159: length 11.6
  Top Layer w0.508: U4.2 36.39,27.62 35.29,28.72 35.29,30.59 ; L1.1 C15.2
$3N11163: length 4
  Top Layer w0.508: C15.1 42.54,30.61 43.05,30.1 43.05,29.08 42.54,28.57 U4.6
$3N11430: length 17.2
  Top Layer w0.508: R8.2 35.31,36.61 ; L1.2 C17.2 C16.2 D2.1
$3N11747: length 9.5
  Top Layer w0.508: C18.2 44.07,28.07 R10.2 R8.1
$3N11772: length 7.2
  Top Layer w0.508: U4.4 R10.1 ; R10.1 R11.2 ; R10.1 C18.1
$3N14838: length 38.5
  Top Layer w0.508: 60.83,47.26 65.66,52.09 65.66,77.93 SPK1.2
$3N14842: length 41.8
  Top Layer w0.508: 60.83,44.72 67.56,51.45 67.56,78.06 SPK1.1
$3N17578: length 6.5
  Top Layer w0.152: Q1.1 23.39,37.22 23.39,33.78 R14.2
$3N17579: length 3.5
  Top Layer w0.711: R13.1 28.96,42.67
$3N17587: length 5.9
  Top Layer w0.152: 14.61,43.71 R16.2 Q2.1
$3N24342: length 7.2
  Top Layer w0.152: Q2.3 13.66,34.73 14.61,33.78 19.32,33.78
$3N25498: length 38.2
  Top Layer w2.032: BAT1.4 BAT1.3
  Bottom Layer w2.032: BAT1.4 BAT1.3

## Copper pours and planes (outline as drawn; the poured copper is in the pictures)
3V3 on Top Layer: 37.83,56.94 48.39,56.94 48.39,53.51 37.83,53.51
3V3 on Inner2: 0.26,94.74 84.74,94.74 84.74,0.26 0.26,0.26
GND on Top Layer: 19.3,48.01 20.83,48.01 20.83,45.21 19.3,45.21
GND on Top Layer: -9.27,105.28 126.87,105.28 126.87,-16 -9.27,-16
GND on Top Layer: 39.32,78.02 43.53,78.02 43.53,73.81 39.32,73.81
GND on Bottom Layer: 39.32,78.02 43.53,78.02 43.53,73.81 39.32,73.81
GND on Bottom Layer: -10.41,108.71 121.41,108.71 121.41,-10.92 -10.41,-10.92
GND on Inner1: 0.26,94.74 84.74,94.74 84.74,0.26 0.26,0.26

Small or netless copper shapes (teardrops, artwork), in the pictures only: 303 on Top Layer, 32 on Bottom Layer, 36 on Inner1, 12 on Inner2

## Text on the board
Bottom Silkscreen Layer: 7.4V | GND | - | +
Top Silkscreen Layer: + | GND | CLK | DIO | 3V3 | SCL | SDA | 7.4V
